# EAGLE schematic HackerboatControlBoard (EAGLE 6.6.0)

## Sheet 1 of 9
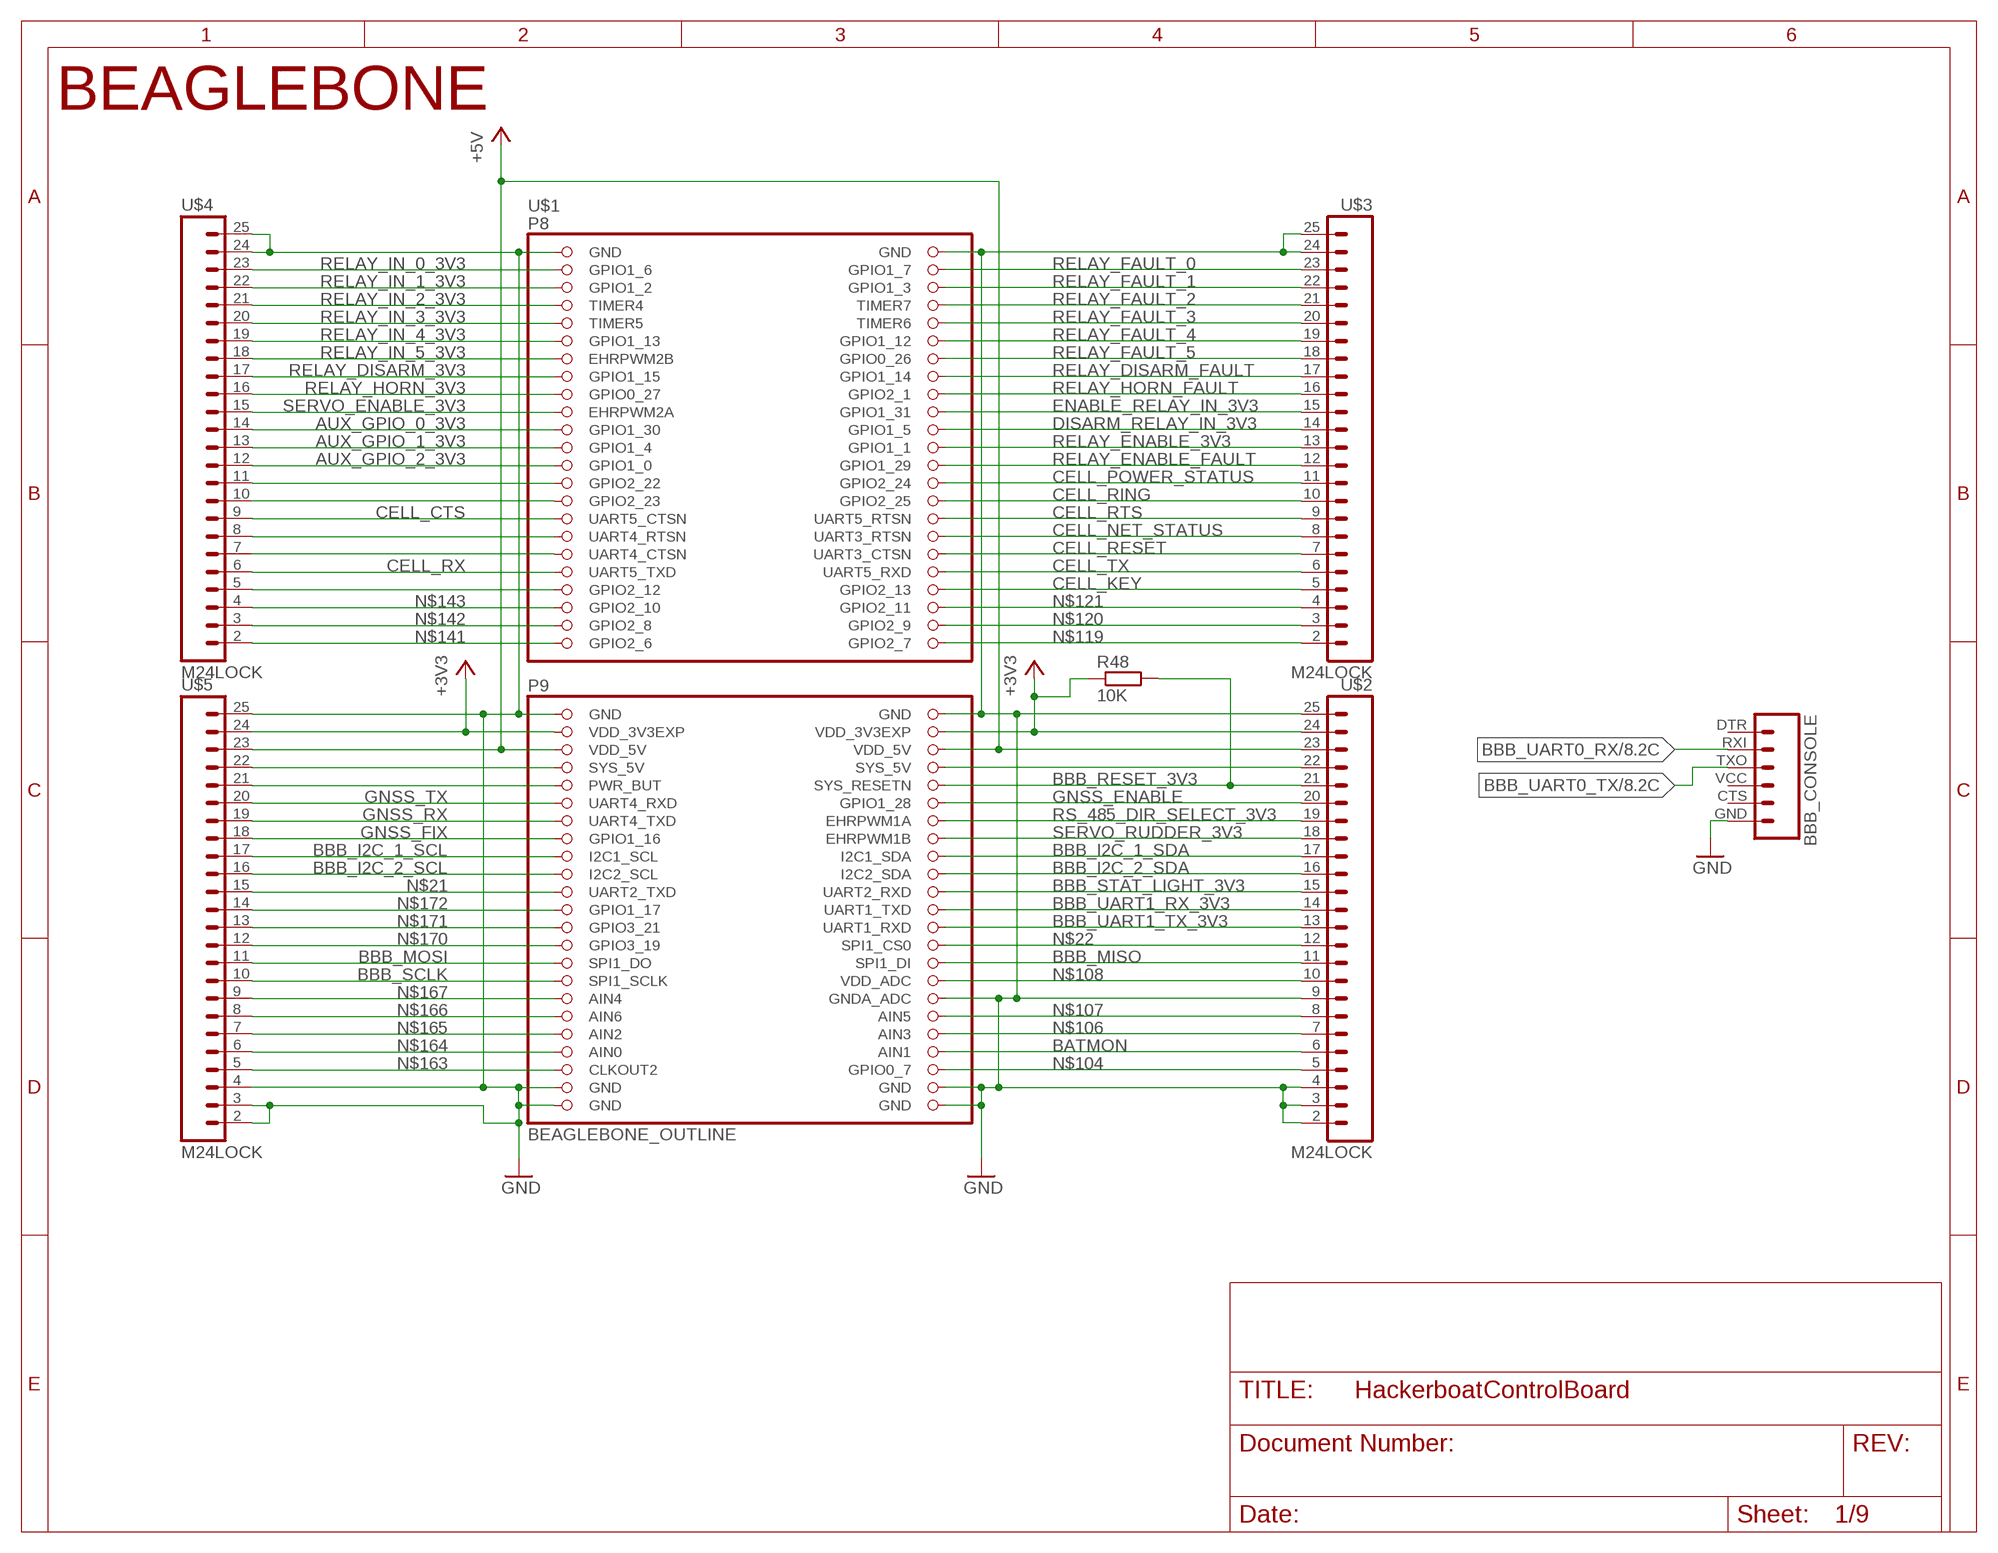
[diagram p0: schematic, sheet 1]

### Parts
BBB_CONSOLE  FTDI_BASICPTH  [FTDI_BASIC]
R48  10K  R-EU_R0603  [R0603]
U$1  BEAGLEBONE_OUTLINE  [BEAGLEBONE_SHIELD]
U$2  M24LOCK  [1X24_LOCK]
U$3  M24LOCK  [1X24_LOCK]
U$4  M24LOCK  [1X24_LOCK]
U$5  M24LOCK  [1X24_LOCK]

### Nets
+3V3: R48.1 U$1.49(VDD_3V3EXP) U$1.50(VDD_3V3EXP) U$2.24 U$5.24 ; also sheet 3,4,5,6,7,8,9
+5V: U$1.51(VDD_5V) U$1.52(VDD_5V) U$2.23 U$5.23 ; also sheet 2,3,4,5,6,7,8,9
AUX_GPIO_0_3V3: U$1.21(GPIO1_30) U$4.14 ; also sheet 7
AUX_GPIO_1_3V3: U$1.23(GPIO1_4) U$4.13 ; also sheet 7
AUX_GPIO_2_3V3: U$1.25(GPIO1_0) U$4.12 ; also sheet 7
BATMON: U$1.86(AIN1) U$2.6 ; also sheet 2
BBB_I2C_1_SCL: U$1.63(I2C1_SCL) U$5.17 ; also sheet 9
BBB_I2C_1_SDA: U$1.64(I2C1_SDA) U$2.17 ; also sheet 9
BBB_I2C_2_SCL: U$1.65(I2C2_SCL) U$5.16 ; also sheet 4
BBB_I2C_2_SDA: U$1.66(I2C2_SDA) U$2.16 ; also sheet 4
BBB_MISO: U$1.76(SPI1_DI) U$2.11 ; also sheet 7
BBB_MOSI: U$1.75(SPI1_DO) U$5.11 ; also sheet 7
BBB_RESET_3V3: R48.2 U$1.56(SYS_RESETN) U$2.21 ; also sheet 7
BBB_SCLK: U$1.77(SPI1_SCLK) U$5.10 ; also sheet 7
BBB_STAT_LIGHT_3V3: U$1.68(UART2_RXD) U$2.15
BBB_UART0_RX: BBB_CONSOLE.RXI ; also sheet 8
BBB_UART0_TX: BBB_CONSOLE.TXO ; also sheet 8
BBB_UART1_RX_3V3: U$1.70(UART1_TXD) U$2.14 ; also sheet 7
BBB_UART1_TX_3V3: U$1.72(UART1_RXD) U$2.13 ; also sheet 7
CELL_CTS: U$1.31(UART5_CTSN) U$4.9 ; also sheet 9
CELL_KEY: U$1.40(GPIO2_13) U$3.5 ; also sheet 9
CELL_NET_STATUS: U$1.34(UART3_RTSN) U$3.8 ; also sheet 9
CELL_POWER_STATUS: U$1.28(GPIO2_24) U$3.11 ; also sheet 9
CELL_RESET: U$1.36(UART3_CTSN) U$3.7 ; also sheet 9
CELL_RING: U$1.30(GPIO2_25) U$3.10 ; also sheet 9
CELL_RTS: U$1.32(UART5_RTSN) U$3.9 ; also sheet 9
CELL_RX: U$1.37(UART5_TXD) U$4.6 ; also sheet 9
CELL_TX: U$1.38(UART5_RXD) U$3.6 ; also sheet 3,9
DISARM_RELAY_IN_3V3: U$1.22(GPIO1_5) U$3.14 ; also sheet 7
ENABLE_RELAY_IN_3V3: U$1.20(GPIO1_31) U$3.15 ; also sheet 7
GND: BBB_CONSOLE.GND U$1.1(GND) U$1.2(GND) U$1.47(GND) U$1.48(GND) U$1.80(GNDA_ADC) U$1.89(GND) U$1.90(GND) U$1.91(GND) U$1.92(GND) U$2.2 U$2.3 U$2.4 U$2.9 U$2.25 U$3.24 U$3.25 U$4.24 U$4.25 U$5.2 U$5.3 U$5.4 U$5.25 ; also sheet 2,3,4,5,6,7,8,9
GNSS_ENABLE: U$1.58(GPIO1_28) U$2.20 ; also sheet 9
GNSS_FIX: U$1.61(GPIO1_16) U$5.18 ; also sheet 9
GNSS_RX: U$1.59(UART4_TXD) U$5.19 ; also sheet 9
GNSS_TX: U$1.57(UART4_RXD) U$5.20 ; also sheet 3,9
N$21: U$1.67(UART2_TXD) U$5.15
N$22: U$1.74(SPI1_CS0) U$2.12
N$46: U$1.27(GPIO2_22) U$4.11
N$47: U$1.29(GPIO2_23) U$4.10
N$56: U$1.33(UART4_RTSN) U$4.8
N$57: U$1.35(UART4_CTSN) U$4.7
N$58: U$1.39(GPIO2_12) U$4.5
N$104: U$1.88(GPIO0_7) U$2.5
N$106: U$1.84(AIN3) U$2.7
N$107: U$1.82(AIN5) U$2.8
N$108: U$1.78(VDD_ADC) U$2.10
N$117: U$1.54(SYS_5V) U$2.22
N$119: U$1.46(GPIO2_7) U$3.2
N$120: U$1.44(GPIO2_9) U$3.3
N$121: U$1.42(GPIO2_11) U$3.4
N$141: U$1.45(GPIO2_6) U$4.2
N$142: U$1.43(GPIO2_8) U$4.3
N$143: U$1.41(GPIO2_10) U$4.4
N$163: U$1.87(CLKOUT2) U$5.5
N$164: U$1.85(AIN0) U$5.6
N$165: U$1.83(AIN2) U$5.7
N$166: U$1.81(AIN6) U$5.8
N$167: U$1.79(AIN4) U$5.9
N$170: U$1.73(GPIO3_19) U$5.12
N$171: U$1.71(GPIO3_21) U$5.13
N$172: U$1.69(GPIO1_17) U$5.14
N$176: U$1.55(PWR_BUT) U$5.21
RELAY_DISARM_3V3: U$1.15(GPIO1_15) U$4.17 ; also sheet 7
RELAY_DISARM_FAULT: U$1.16(GPIO1_14) U$3.17 ; also sheet 6,8
RELAY_ENABLE_3V3: U$1.24(GPIO1_1) U$3.13 ; also sheet 7
RELAY_ENABLE_FAULT: U$1.26(GPIO1_29) U$3.12 ; also sheet 6,8
RELAY_FAULT_0: U$1.4(GPIO1_7) U$3.23 ; also sheet 5,8
RELAY_FAULT_1: U$1.6(GPIO1_3) U$3.22 ; also sheet 5,8
RELAY_FAULT_2: U$1.8(TIMER7) U$3.21 ; also sheet 5,8
RELAY_FAULT_3: U$1.10(TIMER6) U$3.20 ; also sheet 5,8
RELAY_FAULT_4: U$1.12(GPIO1_12) U$3.19 ; also sheet 5,8
RELAY_FAULT_5: U$1.14(GPIO0_26) U$3.18 ; also sheet 5,8
RELAY_HORN_3V3: U$1.17(GPIO0_27) U$4.16 ; also sheet 7
RELAY_HORN_FAULT: U$1.18(GPIO2_1) U$3.16 ; also sheet 6,8
RELAY_IN_0_3V3: U$1.3(GPIO1_6) U$4.23 ; also sheet 7
RELAY_IN_1_3V3: U$1.5(GPIO1_2) U$4.22 ; also sheet 7
RELAY_IN_2_3V3: U$1.7(TIMER4) U$4.21 ; also sheet 7
RELAY_IN_3_3V3: U$1.9(TIMER5) U$4.20 ; also sheet 7
RELAY_IN_4_3V3: U$1.11(GPIO1_13) U$4.19 ; also sheet 7
RELAY_IN_5_3V3: U$1.13(EHRPWM2B) U$4.18 ; also sheet 7
RS_485_DIR_SELECT_3V3: U$1.60(EHRPWM1A) U$2.19 ; also sheet 7
SERVO_ENABLE_3V3: U$1.19(EHRPWM2A) U$4.15 ; also sheet 7
SERVO_RUDDER_3V3: U$1.62(EHRPWM1B) U$2.18 ; also sheet 7
SYS_5V: U$1.53(SYS_5V) U$5.22
Unconnected: BBB_CONSOLE.CTS BBB_CONSOLE.DTR BBB_CONSOLE.VCC

### Notes on the sheet
- BEAGLEBONE

## Sheet 2 of 9
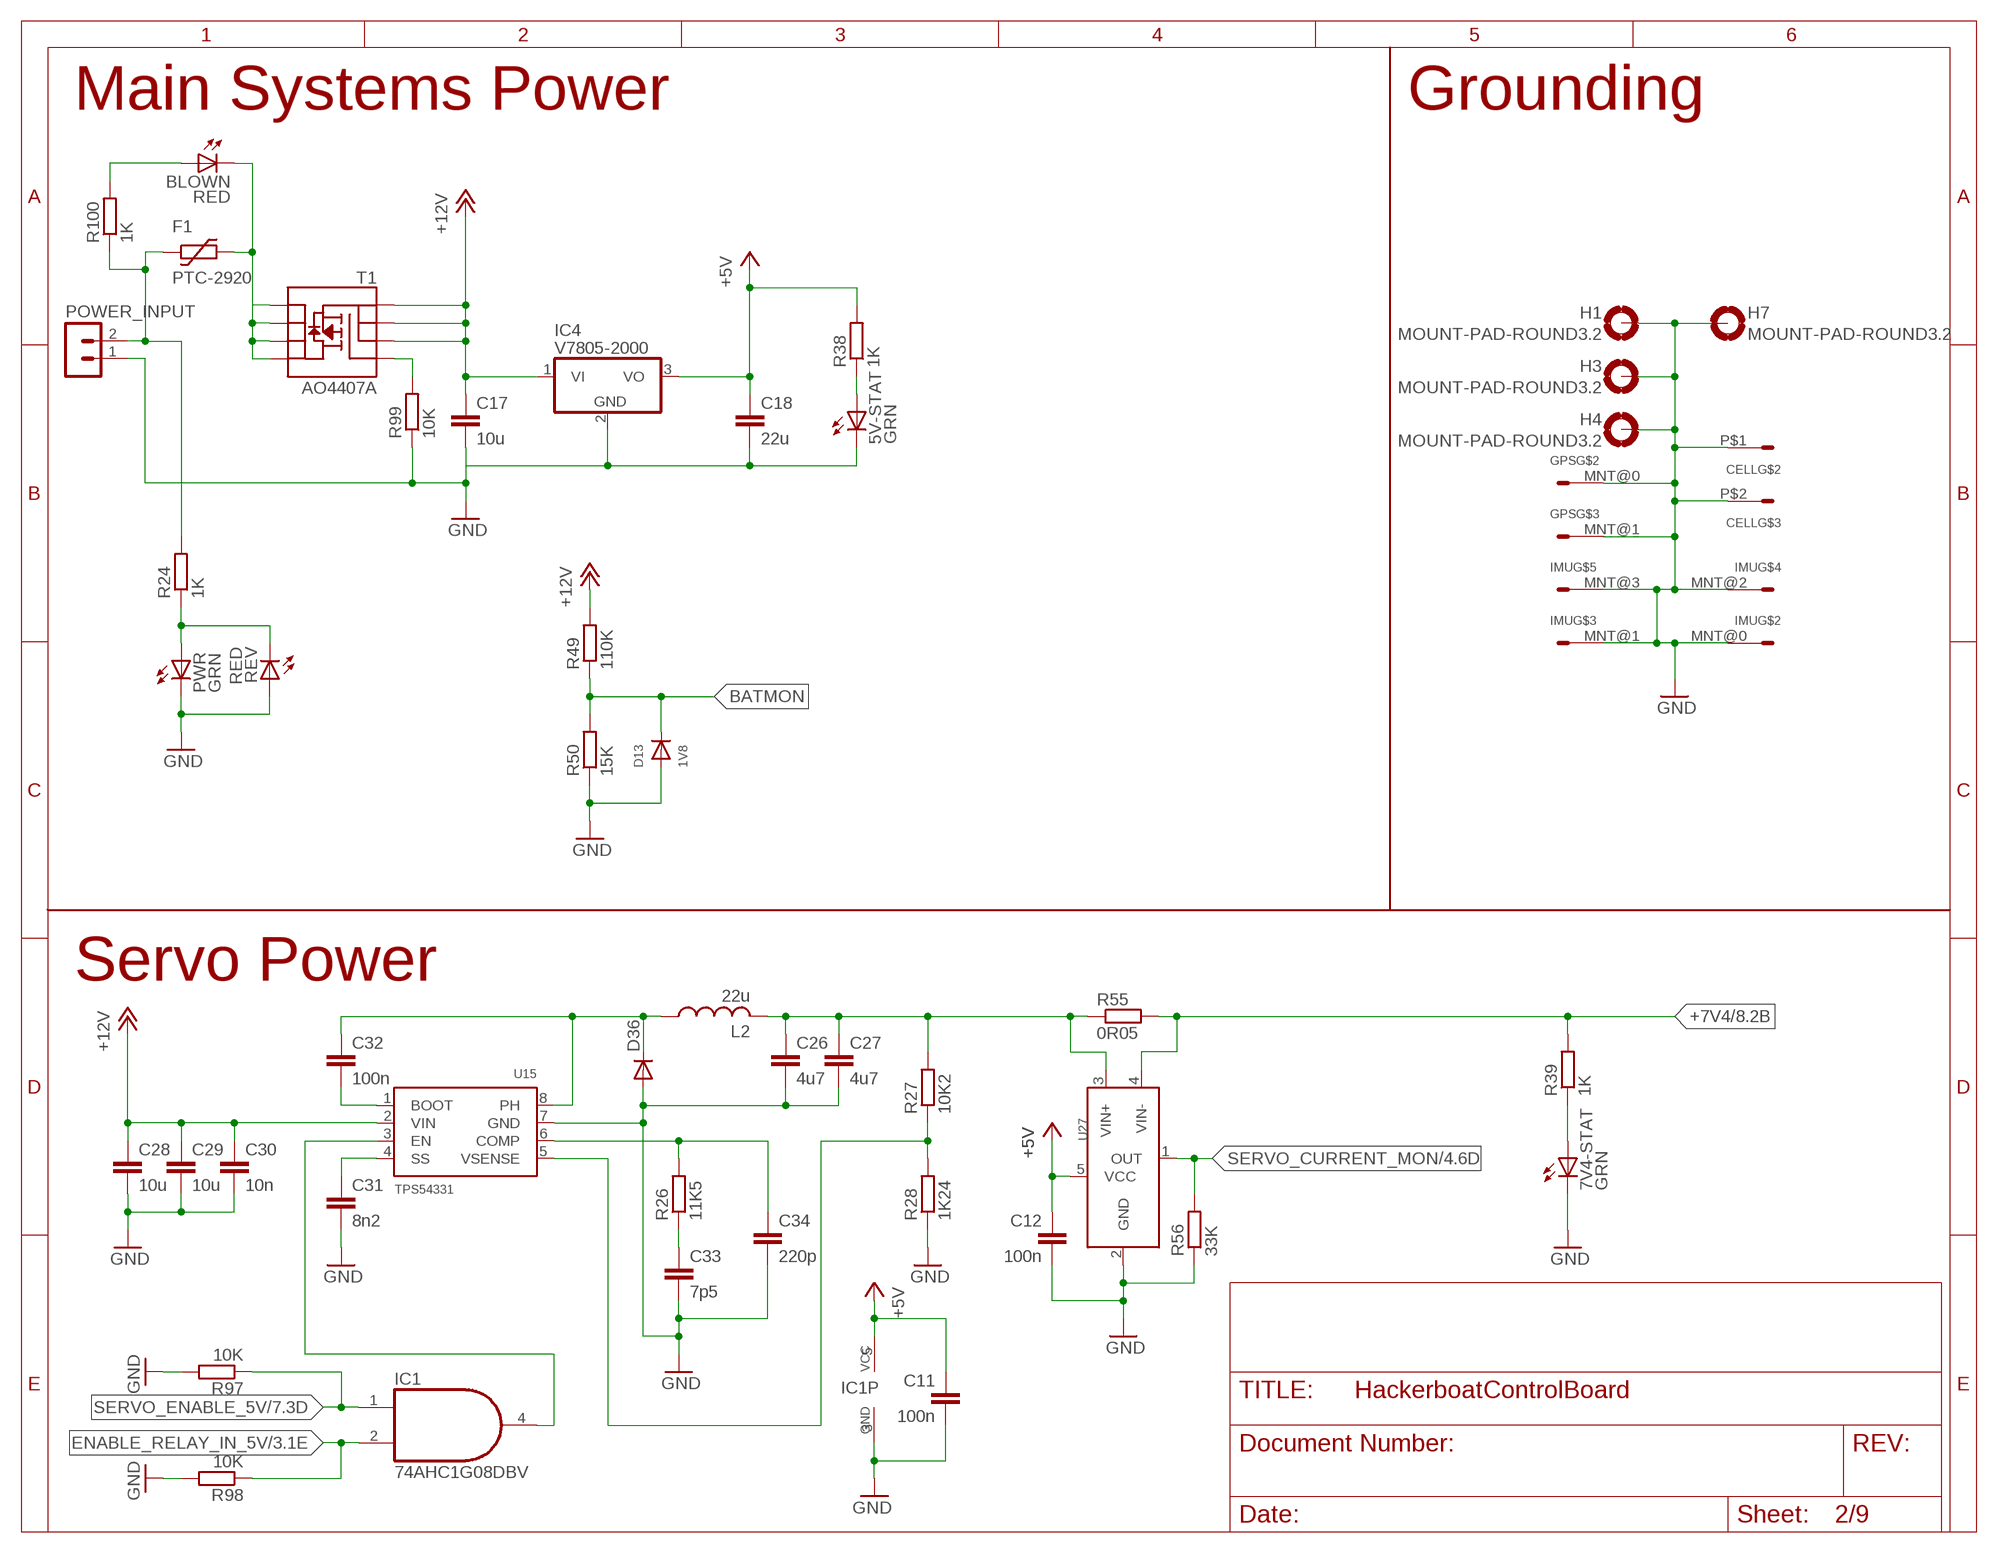
[diagram p1: schematic, sheet 2]

### Parts
5V-STAT  GRN  LEDCHIPLED_0805  [CHIPLED_0805]
7V4-STAT  GRN  LEDCHIPLED_0805  [CHIPLED_0805]
BLOWN  RED  LEDCHIPLED_0805  [CHIPLED_0805]
C11  100n  C-EUC0603  [C0603]
C12  100n  C-EUC0603  [C0603]
C17  10u  C-EUC1210  [C1210]
C18  22u  C-EUC1210  [C1210]
C26  4u7  C-EUC1210  [C1210]
C27  4u7  C-EUC1210  [C1210]
C28  10u  C-EUC1210  [C1210]
C29  10u  C-EUC1210  [C1210]
C30  10n  C-EUC0603  [C0603]
C31  8n2  C-EUC0603  [C0603]
C32  100n  C-EUC0603  [C0603]
C33  7p5  C-EUC0603  [C0603]
C34  220p  C-EUC0603  [C0603]
CELL  FONA  [FONA-3G]
D13  1V8  DIODESOD-123  [SOD-123]
D36  SPARKFUN_DIODESMA  [SPARKFUN_SMA-DIODE]
F1  PTC-2920  [2920L]
GPS  ULTIMATE-GPS  [ULTIMATE-GPS]
H1  MOUNT-PAD-ROUND3.2  [3,2-PAD]
H3  MOUNT-PAD-ROUND3.2  [3,2-PAD]
H4  MOUNT-PAD-ROUND3.2  [3,2-PAD]
H7  MOUNT-PAD-ROUND3.2  [3,2-PAD]
IC1  74AHC1G08DBV  [SOT23-5]
IC4  V7805-2000  7805TV  [TO220V]
IMU  9-DOF-BREAKOUT  [9-DOF-BREAKOUT]
L2  22u  NR6045  [NR60XX]
POWER_INPUT  3-1437664-0  [CONN-2]
PWR  GRN  LEDCHIPLED_0805  [CHIPLED_0805]
R24  1K  R-EU_R0603  [R0603]
R26  11K5  R-EU_R0603  [R0603]
R27  10K2  R-EU_R0603  [R0603]
R28  1K24  R-EU_R0603  [R0603]
R38  1K  R-EU_R0603  [R0603]
R39  1K  R-EU_R0603  [R0603]
R49  110K  R-EU_R0603  [R0603]
R50  15K  R-EU_R0603  [R0603]
R55  0R05  R-EU_R2512  [R2512]
R56  33K  R-EU_R0603  [R0603]
R97  10K  R-EU_R0603  [R0603]
R98  10K  R-EU_R0603  [R0603]
R99  10K  R-EU_R0603  [R0603]
R100  1K  R-EU_R0603  [R0603]
REV  RED  LEDCHIPLED_0805  [CHIPLED_0805]
T1  AO4407A  MOSFET-PCHANNEL-SOIC8SOIC8  [SO08]
U15  TPS54331  [SO08]
U27  INA169  [SOT23-5L]

### Nets
+5V: C11.1 C12.1 C18.1 IC1.5(VCC) IC4.3(VO) R38.2 U27.5(VCC) ; also sheet 1,3,4,5,6,7,8,9
+7V4: R39.2 R55.2 U27.4(VIN-) ; also sheet 8
+7V4_OUT: C26.1 C27.1 L2.2 R27.2 R55.1 U27.3(VIN+)
+12V: C17.1 C28.1 C29.1 C30.1 IC4.1(VI) R49.2 T1.1(S) T1.2(S) T1.3(S) U15.2(VIN) ; also sheet 3,5,6,9
BATMON: D13.C R49.1 R50.2 ; also sheet 1
ENABLE_RELAY_IN_5V: IC1.2(I1) R98.1 ; also sheet 3,7
GND: 5V-STAT.C 7V4-STAT.C C11.2 C12.2 C17.2 C18.2 C26.2 C27.2 C28.2 C29.2 C30.2 C31.2 C33.2 C34.2 CELL.P$1 CELL.P$2 D13.A D36.A GPS.MNT@0 GPS.MNT@1 H1.B3,2(MOUNT) H3.B3,2(MOUNT) H4.B3,2(MOUNT) H7.B3,2(MOUNT) IC1.3(GND) IC4.2(GND) IMU.MNT@0 IMU.MNT@1 IMU.MNT@2 IMU.MNT@3 POWER_INPUT.1 PWR.C R28.1 R50.1 R56.1 R97.2 R98.2 R99.1 REV.A U15.7(GND) U27.2(GND) ; also sheet 1,3,4,5,6,7,8,9
N$36: IC1.4(O) U15.3(EN)
N$72: C31.1 U15.4(SS)
N$78: C32.2 U15.1(BOOT)
N$79: C32.1 D36.C L2.1 U15.8(PH)
N$80: C33.1 R26.1
N$81: C34.1 R26.2 U15.6(COMP)
N$82: R27.1 R28.2 U15.5(VSENSE)
N$96: BLOWN.C F1.P$2 T1.5(D) T1.6(D) T1.7(D) T1.8(D)
N$97: R99.2 T1.4(G)
N$98: F1.P$1 POWER_INPUT.2 R24.2 R100.1
N$99: BLOWN.A R100.2
N$177: PWR.A R24.1 REV.C
N$182: 5V-STAT.A R38.1
N$183: 7V4-STAT.A R39.1
SERVO_CURRENT_MON: R56.2 U27.1(OUT) ; also sheet 4
SERVO_ENABLE_5V: IC1.1(I0) R97.1 ; also sheet 7

### Notes on the sheet
- Main Systems Power | Grounding
- Servo Power

## Sheet 3 of 9
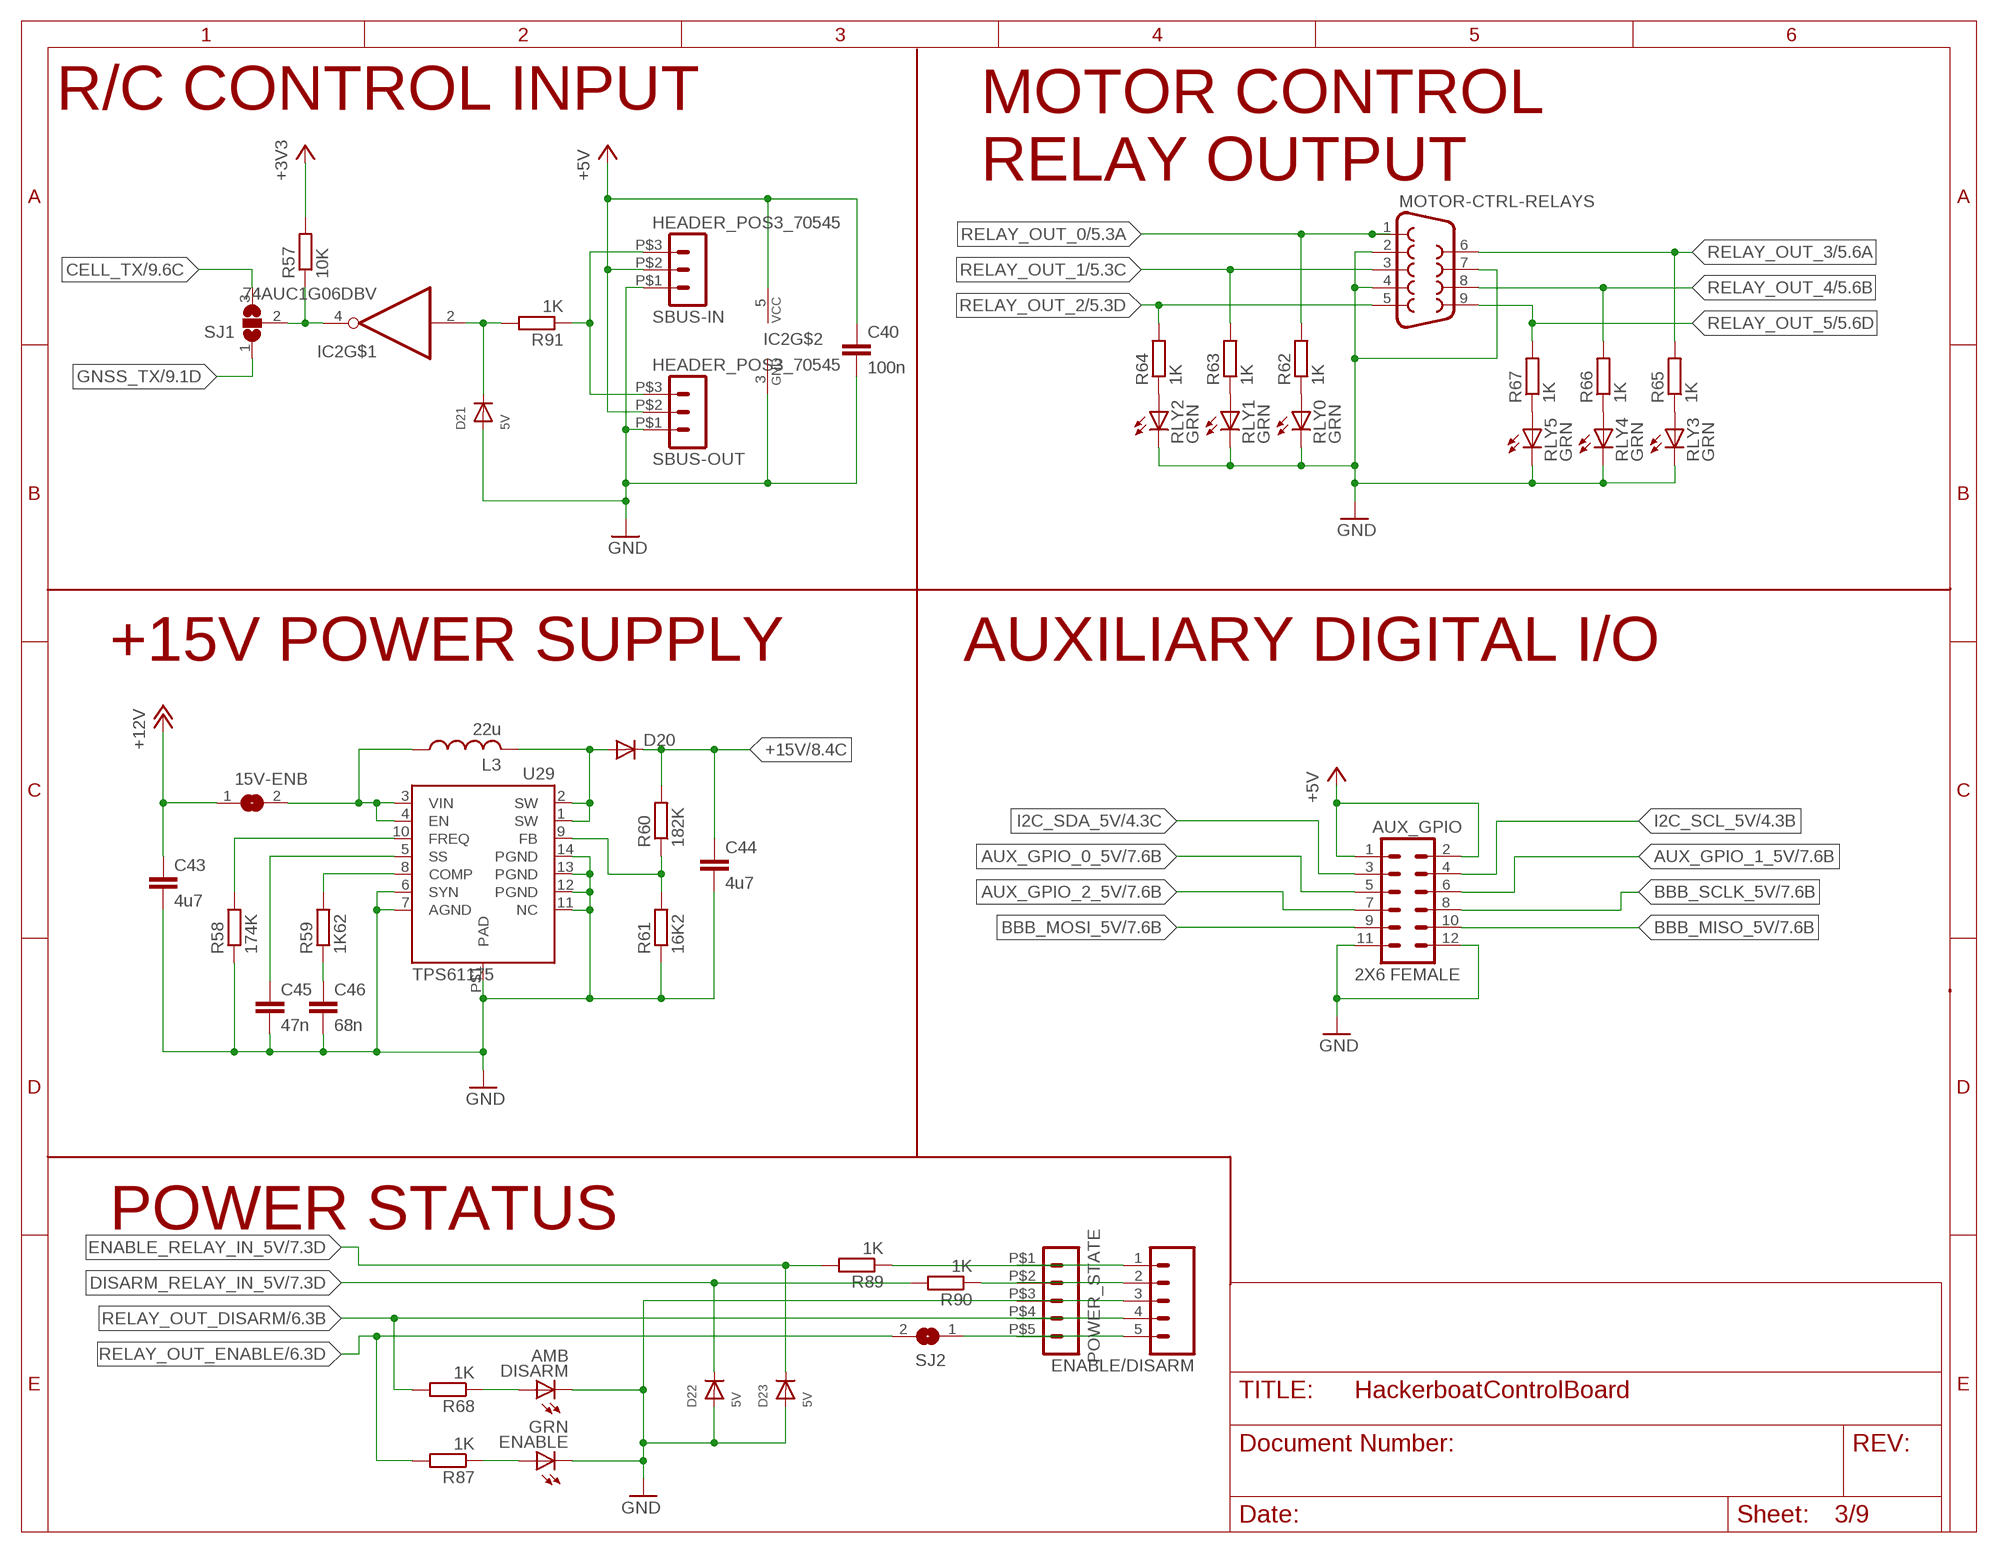
[diagram p2: schematic, sheet 3]

### Parts
15V-ENB  SJ  [SJ]
AUX_GPIO  2X6 FEMALE  M06X2PTH_FEMALE  [2X6]
C40  100n  C-EUC0603  [C0603]
C43  4u7  C-EUC1210  [C1210]
C44  4u7  C-EUC1210  [C1210]
C45  47n  C-EUC0603  [C0603]
C46  68n  C-EUC0603  [C0603]
D20  SPARKFUN_DIODESMA  [SPARKFUN_SMA-DIODE]
D21  5V  DIODESOD-123  [SOD-123]
D22  5V  DIODESOD-123  [SOD-123]
D23  5V  DIODESOD-123  [SOD-123]
DISARM  AMB  LEDCHIPLED_0805  [CHIPLED_0805]
ENABLE  GRN  LEDCHIPLED_0805  [CHIPLED_0805]
ENABLE/DISARM  M05LOCK  [1X05_LOCK]
IC2  74AUC1G06DBV  [SOT23-5]
L3  22u  SRN8040  [SRN8040]
MOTOR-CTRL-RELAYS  DB9FEMALE  [DB9]
POWER_STATE  HEADER_POS5_70555  [70555-POS5]
R57  10K  R-EU_R0603  [R0603]
R58  174K  R-EU_R0603  [R0603]
R59  1K62  R-EU_R0603  [R0603]
R60  182K  R-EU_R0603  [R0603]
R61  16K2  R-EU_R0603  [R0603]
R62  1K  R-EU_R0603  [R0603]
R63  1K  R-EU_R0603  [R0603]
R64  1K  R-EU_R0603  [R0603]
R65  1K  R-EU_R0603  [R0603]
R66  1K  R-EU_R0603  [R0603]
R67  1K  R-EU_R0603  [R0603]
R68  1K  R-EU_R0603  [R0603]
R87  1K  R-EU_R0603  [R0603]
R89  1K  R-EU_R0603  [R0603]
R90  1K  R-EU_R0603  [R0603]
R91  1K  R-EU_R0603  [R0603]
RLY0  GRN  LEDCHIPLED_0805  [CHIPLED_0805]
RLY1  GRN  LEDCHIPLED_0805  [CHIPLED_0805]
RLY2  GRN  LEDCHIPLED_0805  [CHIPLED_0805]
RLY3  GRN  LEDCHIPLED_0805  [CHIPLED_0805]
RLY4  GRN  LEDCHIPLED_0805  [CHIPLED_0805]
RLY5  GRN  LEDCHIPLED_0805  [CHIPLED_0805]
SBUS-IN  HEADER_POS3_70545  [70545-POS3]
SBUS-OUT  HEADER_POS3_70545  [70545-POS3]
SJ1  SJ2W  [SJ_2]
SJ2  SJ  [SJ]
U29  TPS61175  [HTSSOP14]

### Nets
+3V3: R57.2 ; also sheet 1,4,5,6,7,8,9
+5V: AUX_GPIO.1 AUX_GPIO.2 C40.1 IC2.5(VCC) SBUS-IN.P$2 SBUS-OUT.P$2 ; also sheet 1,2,4,5,6,7,8,9
+12V: 15V-ENB.1 C43.1 ; also sheet 2,5,6,9
+15V: C44.1 D20.C R60.2 ; also sheet 8
AUX_GPIO_0_5V: AUX_GPIO.5 ; also sheet 7
AUX_GPIO_1_5V: AUX_GPIO.6 ; also sheet 7
AUX_GPIO_2_5V: AUX_GPIO.7 ; also sheet 7
BBB_MISO_5V: AUX_GPIO.10 ; also sheet 7
BBB_MOSI_5V: AUX_GPIO.9 ; also sheet 7
BBB_SCLK_5V: AUX_GPIO.8 ; also sheet 7
CELL_TX: SJ1.3 ; also sheet 1,9
DISARM_RELAY_IN_5V: D22.C R90.2 ; also sheet 7
ENABLE_RELAY_IN_5V: D23.C R89.2 ; also sheet 2,7
GND: AUX_GPIO.11 AUX_GPIO.12 C40.2 C43.2 C44.2 C45.2 C46.2 D21.A D22.A D23.A DISARM.C ENABLE.C ENABLE/DISARM.3 IC2.3(GND) MOTOR-CTRL-RELAYS.2 MOTOR-CTRL-RELAYS.4 MOTOR-CTRL-RELAYS.7 POWER_STATE.P$3 R58.1 R61.1 RLY0.C RLY1.C RLY2.C RLY3.C RLY4.C RLY5.C SBUS-IN.P$1 SBUS-OUT.P$1 U29.6(SYN) U29.7(AGND) U29.11(NC) U29.12(PGND) U29.13(PGND) U29.14(PGND) U29.P$1(PAD) ; also sheet 1,2,4,5,6,7,8,9
GNSS_TX: SJ1.1 ; also sheet 1,9
I2C_SCL_5V: AUX_GPIO.4 ; also sheet 4
I2C_SDA_5V: AUX_GPIO.3 ; also sheet 4
N$53: D21.C IC2.2(I) R91.2
N$55: IC2.4(O) R57.1 SJ1.2
N$59: R62.1 RLY0.A
N$60: R63.1 RLY1.A
N$61: R64.1 RLY2.A
N$64: DISARM.A R68.1
N$65: R65.1 RLY3.A
N$66: R66.1 RLY4.A
N$67: R67.1 RLY5.A
N$71: ENABLE.A R87.1
N$75: C46.1 R59.1
N$76: R59.2 U29.8(COMP)
N$77: C45.1 U29.5(SS)
N$83: R58.2 U29.10(FREQ)
N$84: D20.A L3.2 U29.1(SW) U29.2(SW)
N$85: R60.1 R61.2 U29.9(FB)
N$87: ENABLE/DISARM.1 POWER_STATE.P$1 R89.1
N$88: ENABLE/DISARM.2 POWER_STATE.P$2 R90.1
N$94: 15V-ENB.2 L3.1 U29.3(VIN) U29.4(EN)
N$95: ENABLE/DISARM.5 POWER_STATE.P$5 SJ2.1
RELAY_OUT_0: MOTOR-CTRL-RELAYS.1 R62.2 ; also sheet 5
RELAY_OUT_1: MOTOR-CTRL-RELAYS.3 R63.2 ; also sheet 5
RELAY_OUT_2: MOTOR-CTRL-RELAYS.5 R64.2 ; also sheet 5
RELAY_OUT_3: MOTOR-CTRL-RELAYS.6 R65.2 ; also sheet 5
RELAY_OUT_4: MOTOR-CTRL-RELAYS.8 R66.2 ; also sheet 5
RELAY_OUT_5: MOTOR-CTRL-RELAYS.9 R67.2 ; also sheet 5
RELAY_OUT_DISARM: ENABLE/DISARM.4 POWER_STATE.P$4 R68.2 ; also sheet 6
RELAY_OUT_ENABLE: R87.2 SJ2.2 ; also sheet 6
SBUS_IN_5V: R91.1 SBUS-IN.P$3 SBUS-OUT.P$3

### Notes on the sheet
- R/C CONTROL INPUT
- MOTOR CONTROL 
  RELAY OUTPUT
- +15V POWER SUPPLY | AUXILIARY DIGITAL I/O
- POWER STATUS

## Sheet 4 of 9
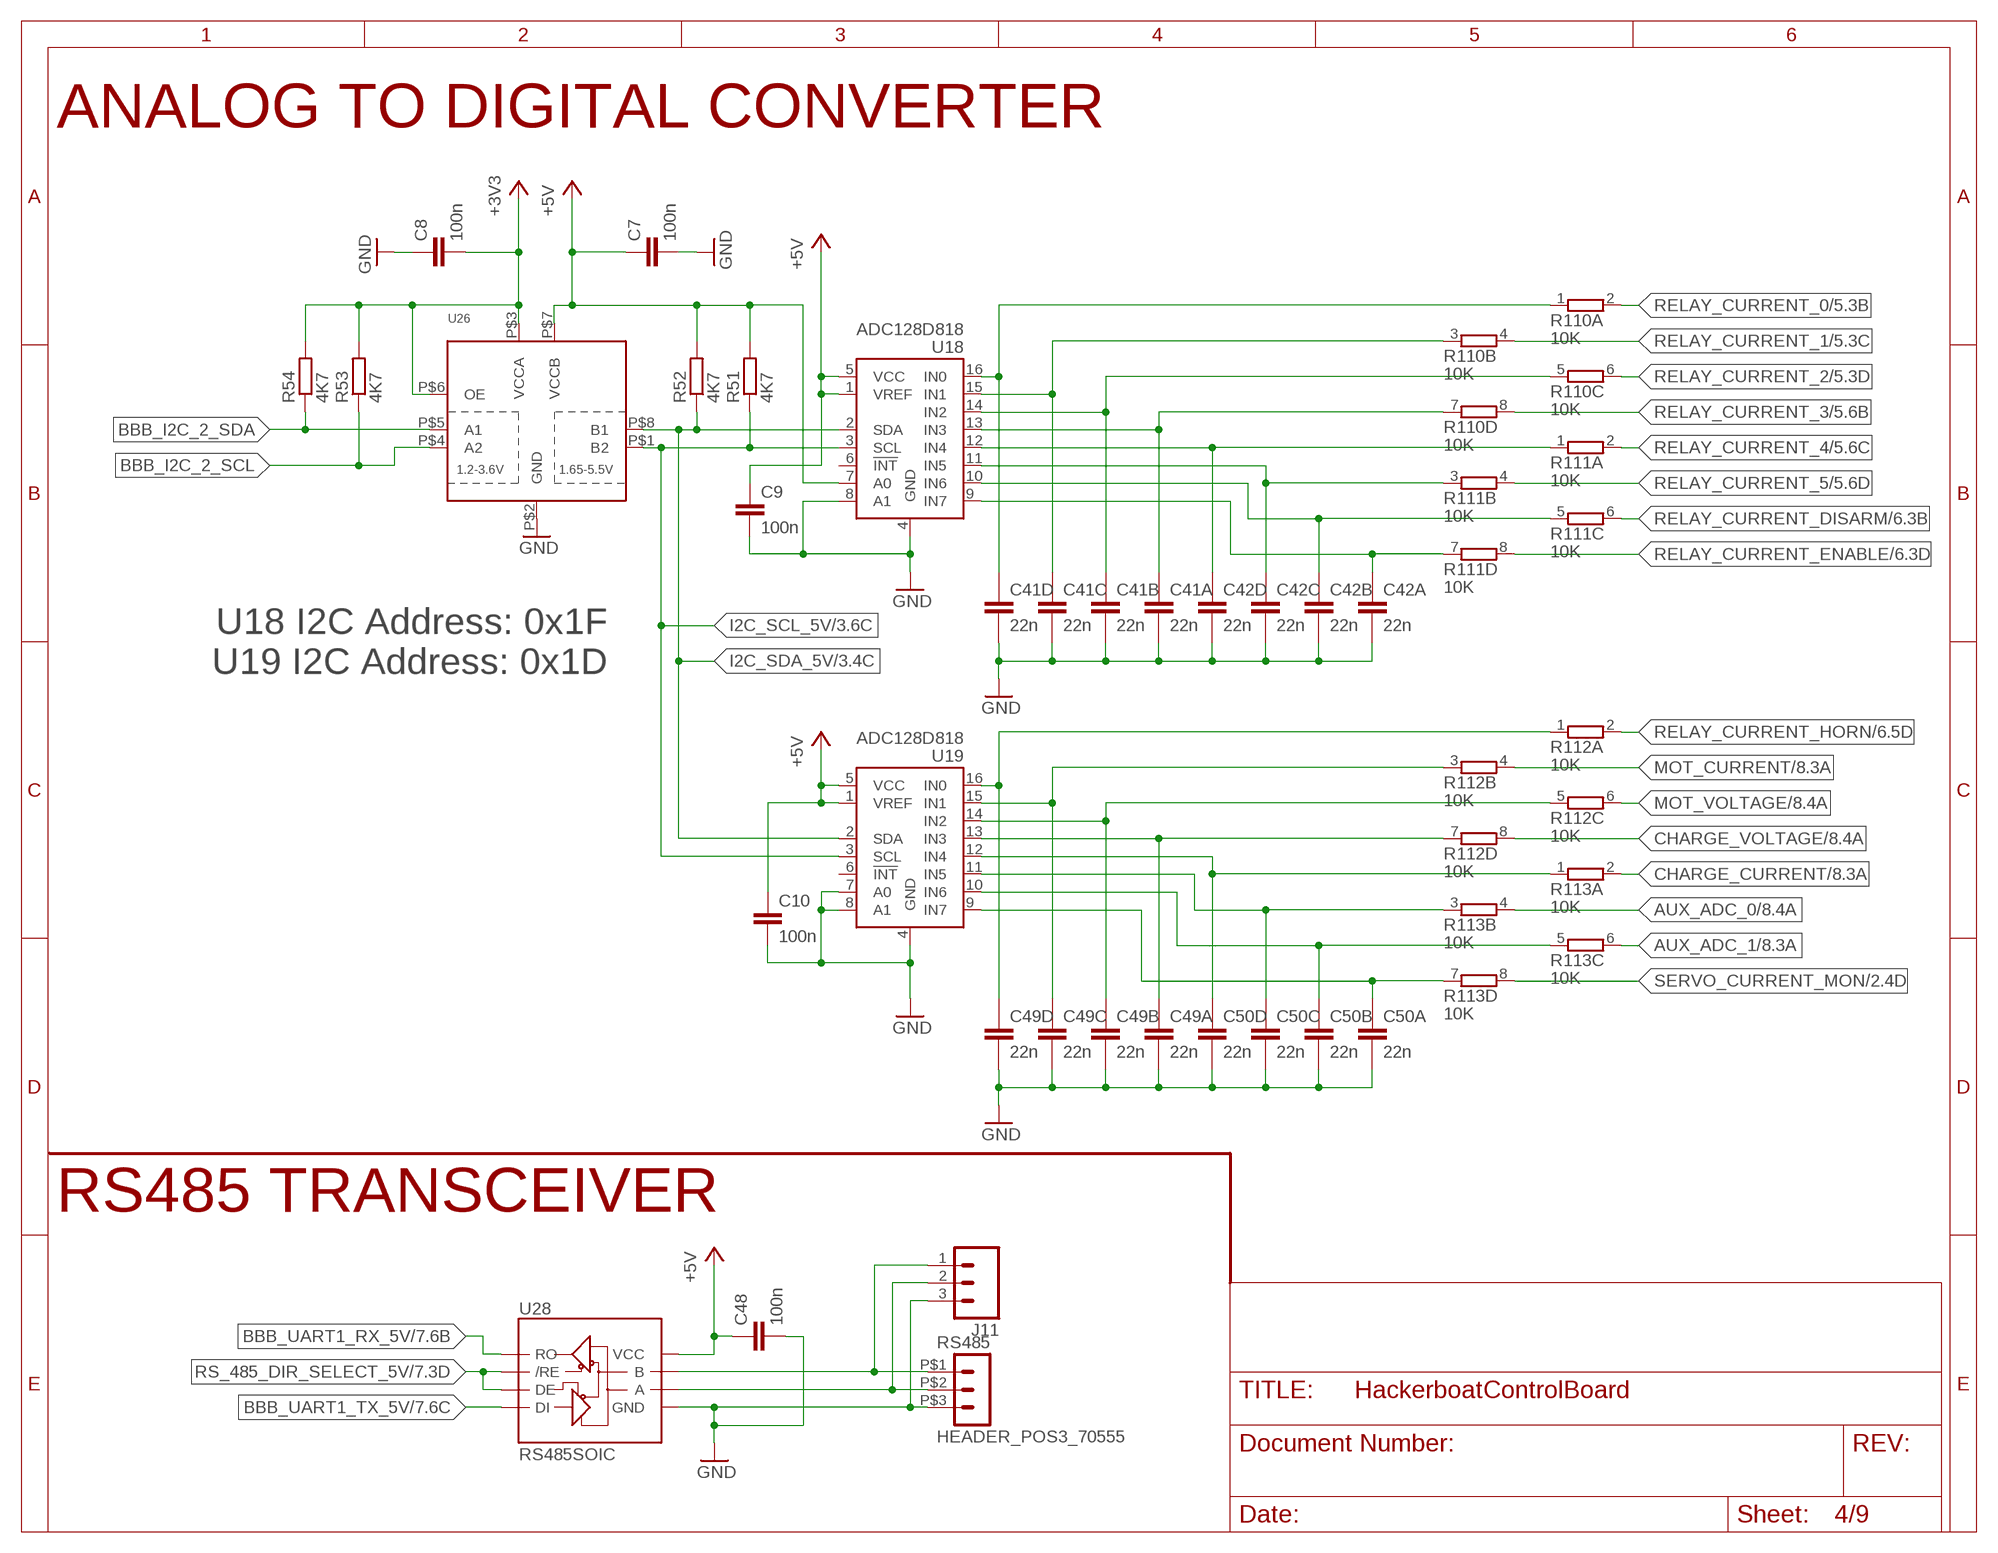
[diagram p3: schematic, sheet 4]

### Parts
C7  100n  C-EUC0603  [C0603]
C8  100n  C-EUC0603  [C0603]
C9  100n  C-EUC0603  [C0603]
C10  100n  C-EUC0603  [C0603]
C41  22n  4CAP0805  [0805X4-CAP]
C42  22n  4CAP0805  [0805X4-CAP]
C48  100n  C-EUC0603  [C0603]
C49  22n  4CAP0805  [0805X4-CAP]
C50  22n  4CAP0805  [0805X4-CAP]
J11  M03LOCK  [1X03_LOCK]
R51  4K7  R-EU_R0603  [R0603]
R52  4K7  R-EU_R0603  [R0603]
R53  4K7  R-EU_R0603  [R0603]
R54  4K7  R-EU_R0603  [R0603]
R110  10K  4R-NCTS742C083  [CTS742C083-RES]
R111  10K  4R-NCTS742C083  [CTS742C083-RES]
R112  10K  4R-NCTS742C083  [CTS742C083-RES]
R113  10K  4R-NCTS742C083  [CTS742C083-RES]
RS485  HEADER_POS3_70555  [70555-POS3]
U18  ADC128D818  [TSSOP16]
U19  ADC128D818  [TSSOP16]
U26  TXS0102  [VFSOP-8]
U28  RS485SOIC  [SO08]

### Nets
+3V3: C8.2 R53.2 R54.2 U26.P$3(VCCA) U26.P$6(OE) ; also sheet 1,3,5,6,7,8,9
+5V: C7.1 C9.1 C10.1 C48.1 R51.2 R52.2 U18.1(VREF) U18.5(VCC) U18.7(A0) U19.1(VREF) U19.5(VCC) U26.P$7(VCCB) U28.8(VCC) ; also sheet 1,2,3,5,6,7,8,9
AUX_ADC_0: R113.4 ; also sheet 8
AUX_ADC_1: R113.6 ; also sheet 8
BBB_I2C_2_SCL: R53.1 U26.P$4(A2) ; also sheet 1
BBB_I2C_2_SDA: R54.1 U26.P$5(A1) ; also sheet 1
BBB_UART1_RX_5V: U28.1(RO) ; also sheet 7
BBB_UART1_TX_5V: U28.4(DI) ; also sheet 7
CHARGE_CURRENT: R113.2 ; also sheet 8
CHARGE_VOLTAGE: R112.8 ; also sheet 8
GND: C7.2 C8.1 C9.2 C10.2 C41.2 C41.4 C41.6 C41.8 C42.2 C42.4 C42.6 C42.8 C48.2 C49.2 C49.4 C49.6 C49.8 C50.2 C50.4 C50.6 C50.8 J11.3 RS485.P$3 U18.4(GND) U18.8(A1) U19.4(GND) U19.7(A0) U19.8(A1) U26.P$2(GND) U28.5(GND) ; also sheet 1,2,3,5,6,7,8,9
I2C_SCL_5V: R51.1 U18.3(SCL) U19.3(SCL) U26.P$1(B2) ; also sheet 3
I2C_SDA_5V: R52.1 U18.2(SDA) U19.2(SDA) U26.P$8(B1) ; also sheet 3
MOT_CURRENT: R112.4 ; also sheet 8
MOT_VOLTAGE: R112.6 ; also sheet 8
N$27: J11.1 RS485.P$1 U28.7(B)
N$86: J11.2 RS485.P$2 U28.6(A)
N$113: C41.7 R110.1 U18.16(IN0)
N$114: C41.5 R110.3 U18.15(IN1)
N$115: C49.7 R112.1 U19.16(IN0)
N$116: C41.3 R110.5 U18.14(IN2)
N$118: C41.1 R110.7 U18.13(IN3)
N$122: C42.7 R111.1 U18.12(IN4)
N$123: C42.5 R111.3 U18.11(IN5)
N$124: C42.3 R111.5 U18.10(IN6)
N$125: C42.1 R111.7 U18.9(IN7)
N$126: C49.5 R112.3 U19.15(IN1)
N$127: C49.3 R112.5 U19.14(IN2)
N$128: C49.1 R112.7 U19.13(IN3)
N$129: C50.7 R113.1 U19.12(IN4)
N$130: C50.5 R113.3 U19.11(IN5)
N$131: C50.3 R113.5 U19.10(IN6)
N$132: C50.1 R113.7 U19.9(IN7)
RELAY_CURRENT_0: R110.2 ; also sheet 5
RELAY_CURRENT_1: R110.4 ; also sheet 5
RELAY_CURRENT_2: R110.6 ; also sheet 5
RELAY_CURRENT_3: R110.8 ; also sheet 5
RELAY_CURRENT_4: R111.2 ; also sheet 5
RELAY_CURRENT_5: R111.4 ; also sheet 5
RELAY_CURRENT_DISARM: R111.6 ; also sheet 6
RELAY_CURRENT_ENABLE: R111.8 ; also sheet 6
RELAY_CURRENT_HORN: R112.2 ; also sheet 6
RS_485_DIR_SELECT_5V: U28.2(/RE) U28.3(DE) ; also sheet 7
SERVO_CURRENT_MON: R113.8 ; also sheet 2
Unconnected: U18.6(!INT!) U19.6(!INT!)

### Notes on the sheet
- ANALOG TO DIGITAL CONVERTER
- U18 I2C Address: 0x1F
  U19 I2C Address: 0x1D
- RS485 TRANSCEIVER

## Sheet 5 of 9
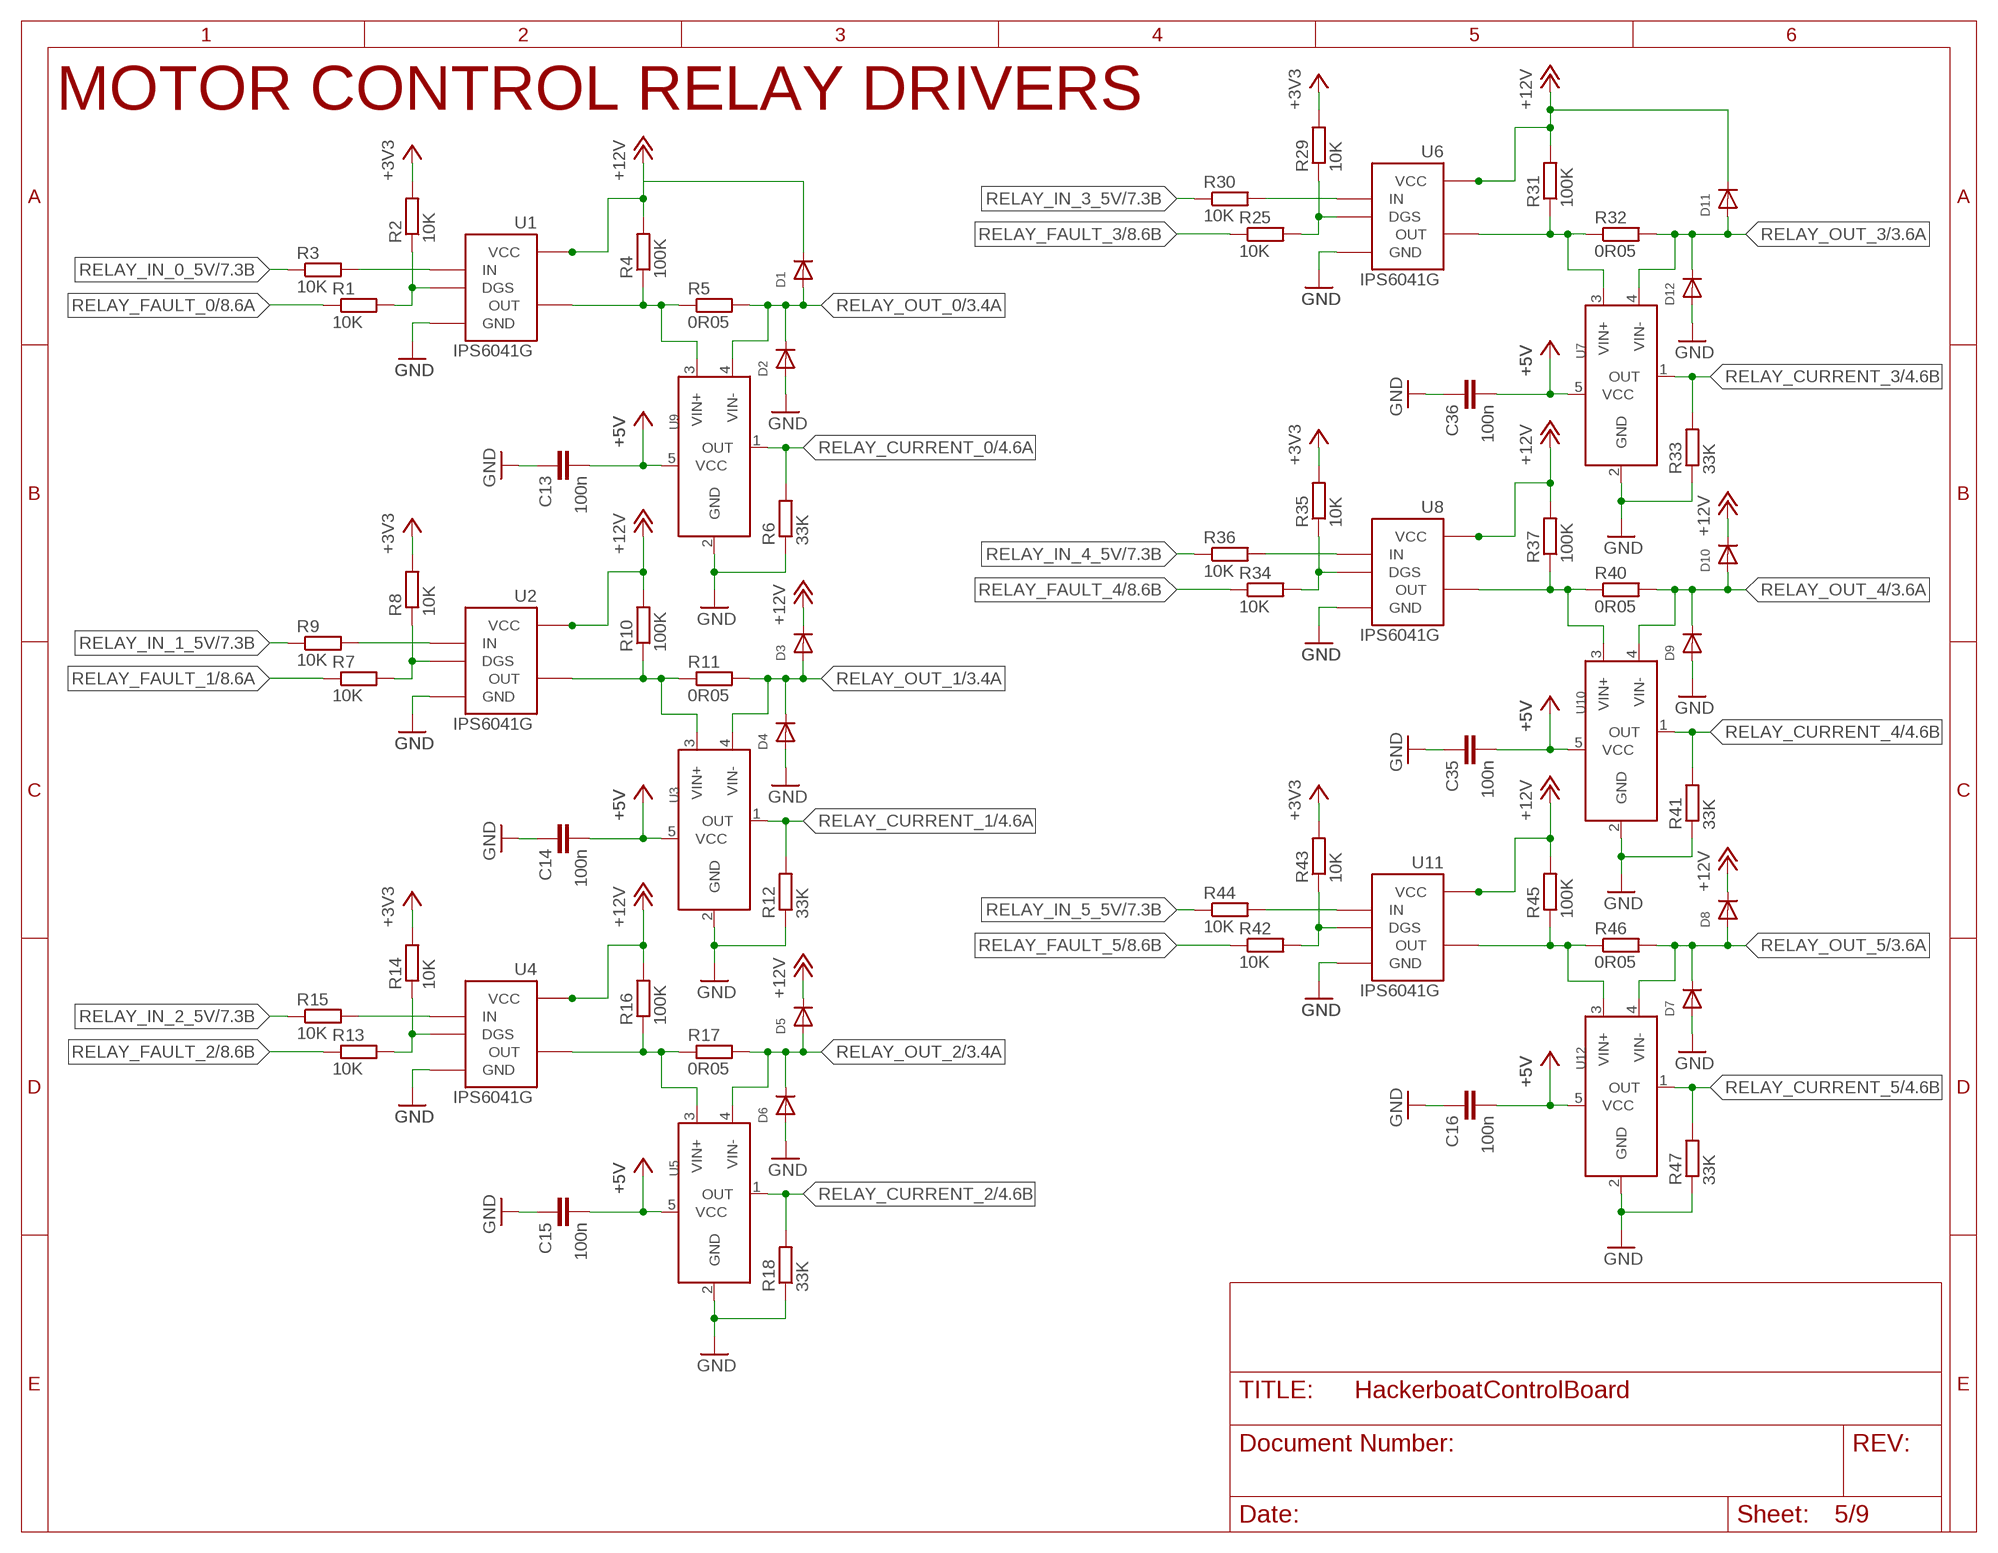
[diagram p4: schematic, sheet 5]

### Parts
C13  100n  C-EUC0603  [C0603]
C14  100n  C-EUC0603  [C0603]
C15  100n  C-EUC0603  [C0603]
C16  100n  C-EUC0603  [C0603]
C35  100n  C-EUC0603  [C0603]
C36  100n  C-EUC0603  [C0603]
D1  DIODESOD-123  [SOD-123]
D2  DIODESOD-123  [SOD-123]
D3  DIODESOD-123  [SOD-123]
D4  DIODESOD-123  [SOD-123]
D5  DIODESOD-123  [SOD-123]
D6  DIODESOD-123  [SOD-123]
D7  DIODESOD-123  [SOD-123]
D8  DIODESOD-123  [SOD-123]
D9  DIODESOD-123  [SOD-123]
D10  DIODESOD-123  [SOD-123]
D11  DIODESOD-123  [SOD-123]
D12  DIODESOD-123  [SOD-123]
R1  10K  R-EU_R0603  [R0603]
R2  10K  R-EU_R0603  [R0603]
R3  10K  R-EU_R0603  [R0603]
R4  100K  R-EU_R0603  [R0603]
R5  0R05  R-EU_R2512  [R2512]
R6  33K  R-EU_R0603  [R0603]
R7  10K  R-EU_R0603  [R0603]
R8  10K  R-EU_R0603  [R0603]
R9  10K  R-EU_R0603  [R0603]
R10  100K  R-EU_R0603  [R0603]
R11  0R05  R-EU_R2512  [R2512]
R12  33K  R-EU_R0603  [R0603]
R13  10K  R-EU_R0603  [R0603]
R14  10K  R-EU_R0603  [R0603]
R15  10K  R-EU_R0603  [R0603]
R16  100K  R-EU_R0603  [R0603]
R17  0R05  R-EU_R2512  [R2512]
R18  33K  R-EU_R0603  [R0603]
R25  10K  R-EU_R0603  [R0603]
R29  10K  R-EU_R0603  [R0603]
R30  10K  R-EU_R0603  [R0603]
R31  100K  R-EU_R0603  [R0603]
R32  0R05  R-EU_R2512  [R2512]
R33  33K  R-EU_R0603  [R0603]
R34  10K  R-EU_R0603  [R0603]
R35  10K  R-EU_R0603  [R0603]
R36  10K  R-EU_R0603  [R0603]
R37  100K  R-EU_R0603  [R0603]
R40  0R05  R-EU_R2512  [R2512]
R41  33K  R-EU_R0603  [R0603]
R42  10K  R-EU_R0603  [R0603]
R43  10K  R-EU_R0603  [R0603]
R44  10K  R-EU_R0603  [R0603]
R45  100K  R-EU_R0603  [R0603]
R46  0R05  R-EU_R2512  [R2512]
R47  33K  R-EU_R0603  [R0603]
U1  IPS6041G  [SO08]
U2  IPS6041G  [SO08]
U3  INA169  [SOT23-5L]
U4  IPS6041G  [SO08]
U5  INA169  [SOT23-5L]
U6  IPS6041G  [SO08]
U7  INA169  [SOT23-5L]
U8  IPS6041G  [SO08]
U9  INA169  [SOT23-5L]
U10  INA169  [SOT23-5L]
U11  IPS6041G  [SO08]
U12  INA169  [SOT23-5L]

### Nets
+3V3: R2.2 R8.2 R14.2 R29.2 R35.2 R43.2 ; also sheet 1,3,4,6,7,8,9
+5V: C13.2 C14.2 C15.2 C16.2 C35.2 C36.2 U3.5(VCC) U5.5(VCC) U7.5(VCC) U9.5(VCC) U10.5(VCC) U12.5(VCC) ; also sheet 1,2,3,4,6,7,8,9
+12V: D1.C D3.C D5.C D8.C D10.C D11.C R4.2 R10.2 R16.2 R31.2 R37.2 R45.2 U1.5(VCC) U1.6(VCC) U1.7(VCC) U1.8(VCC) U2.5(VCC) U2.6(VCC) U2.7(VCC) U2.8(VCC) U4.5(VCC) U4.6(VCC) U4.7(VCC) U4.8(VCC) U6.5(VCC) U6.6(VCC) U6.7(VCC) U6.8(VCC) U8.5(VCC) U8.6(VCC) U8.7(VCC) U8.8(VCC) U11.5(VCC) U11.6(VCC) U11.7(VCC) U11.8(VCC) ; also sheet 2,3,6,9
GND: C13.1 C14.1 C15.1 C16.1 C35.1 C36.1 D2.A D4.A D6.A D7.A D9.A D12.A R6.1 R12.1 R18.1 R33.1 R41.1 R47.1 U1.1(GND) U2.1(GND) U3.2(GND) U4.1(GND) U5.2(GND) U6.1(GND) U7.2(GND) U8.1(GND) U9.2(GND) U10.2(GND) U11.1(GND) U12.2(GND) ; also sheet 1,2,3,4,6,7,8,9
N$1: R1.2 R2.1 U1.3(DGS)
N$2: R3.2 U1.2(IN)
N$3: R4.1 R5.1 U1.4(OUT) U9.3(VIN+)
N$4: R7.2 R8.1 U2.3(DGS)
N$5: R9.2 U2.2(IN)
N$6: R10.1 R11.1 U2.4(OUT) U3.3(VIN+)
N$7: R13.2 R14.1 U4.3(DGS)
N$8: R15.2 U4.2(IN)
N$9: R16.1 R17.1 U4.4(OUT) U5.3(VIN+)
N$10: R25.2 R29.1 U6.3(DGS)
N$11: R30.2 U6.2(IN)
N$12: R31.1 R32.1 U6.4(OUT) U7.3(VIN+)
N$13: R34.2 R35.1 U8.3(DGS)
N$14: R36.2 U8.2(IN)
N$15: R37.1 R40.1 U8.4(OUT) U10.3(VIN+)
N$16: R42.2 R43.1 U11.3(DGS)
N$17: R44.2 U11.2(IN)
N$18: R45.1 R46.1 U11.4(OUT) U12.3(VIN+)
RELAY_CURRENT_0: R6.2 U9.1(OUT) ; also sheet 4
RELAY_CURRENT_1: R12.2 U3.1(OUT) ; also sheet 4
RELAY_CURRENT_2: R18.2 U5.1(OUT) ; also sheet 4
RELAY_CURRENT_3: R33.2 U7.1(OUT) ; also sheet 4
RELAY_CURRENT_4: R41.2 U10.1(OUT) ; also sheet 4
RELAY_CURRENT_5: R47.2 U12.1(OUT) ; also sheet 4
RELAY_FAULT_0: R1.1 ; also sheet 1,8
RELAY_FAULT_1: R7.1 ; also sheet 1,8
RELAY_FAULT_2: R13.1 ; also sheet 1,8
RELAY_FAULT_3: R25.1 ; also sheet 1,8
RELAY_FAULT_4: R34.1 ; also sheet 1,8
RELAY_FAULT_5: R42.1 ; also sheet 1,8
RELAY_IN_0_5V: R3.1 ; also sheet 7
RELAY_IN_1_5V: R9.1 ; also sheet 7
RELAY_IN_2_5V: R15.1 ; also sheet 7
RELAY_IN_3_5V: R30.1 ; also sheet 7
RELAY_IN_4_5V: R36.1 ; also sheet 7
RELAY_IN_5_5V: R44.1 ; also sheet 7
RELAY_OUT_0: D1.A D2.C R5.2 U9.4(VIN-) ; also sheet 3
RELAY_OUT_1: D3.A D4.C R11.2 U3.4(VIN-) ; also sheet 3
RELAY_OUT_2: D5.A D6.C R17.2 U5.4(VIN-) ; also sheet 3
RELAY_OUT_3: D11.A D12.C R32.2 U7.4(VIN-) ; also sheet 3
RELAY_OUT_4: D9.C D10.A R40.2 U10.4(VIN-) ; also sheet 3
RELAY_OUT_5: D7.C D8.A R46.2 U12.4(VIN-) ; also sheet 3

### Notes on the sheet
- MOTOR CONTROL RELAY DRIVERS

## Sheet 6 of 9
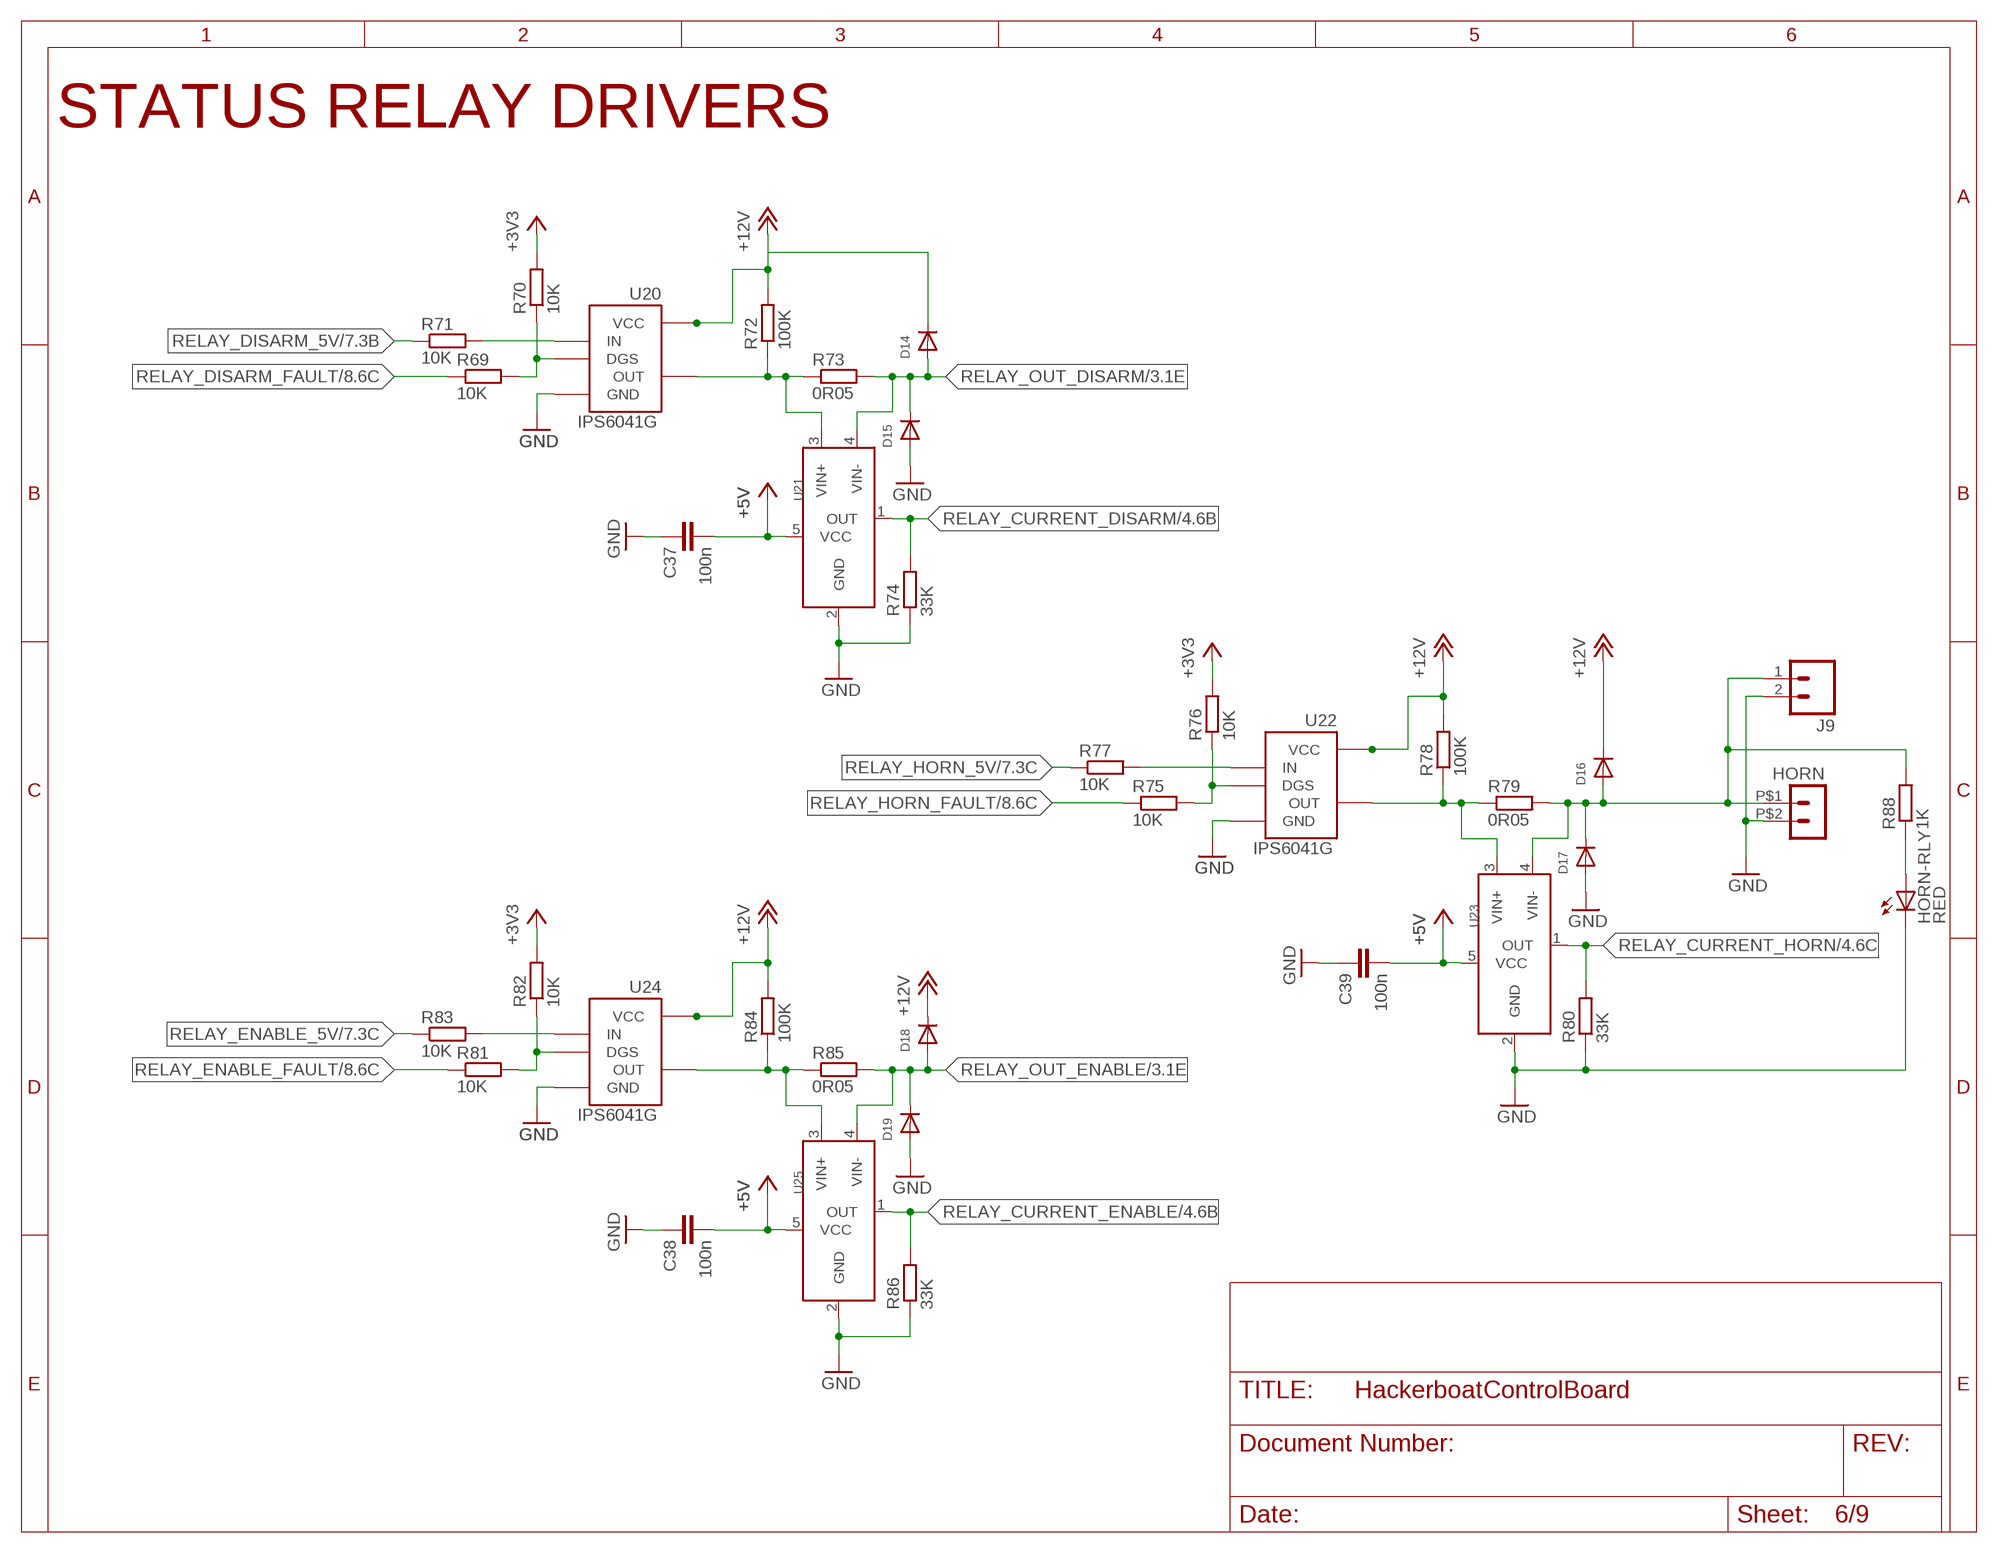
[diagram p5: schematic, sheet 6]

### Parts
C37  100n  C-EUC0603  [C0603]
C38  100n  C-EUC0603  [C0603]
C39  100n  C-EUC0603  [C0603]
D14  DIODESOD-123  [SOD-123]
D15  DIODESOD-123  [SOD-123]
D16  DIODESOD-123  [SOD-123]
D17  DIODESOD-123  [SOD-123]
D18  DIODESOD-123  [SOD-123]
D19  DIODESOD-123  [SOD-123]
HORN  HEADER_POS2_70555  [70555-POS2]
HORN-RLY  RED  LEDCHIPLED_0805  [CHIPLED_0805]
J9  M02LOCK  [1X02_LOCK]
R69  10K  R-EU_R0603  [R0603]
R70  10K  R-EU_R0603  [R0603]
R71  10K  R-EU_R0603  [R0603]
R72  100K  R-EU_R0603  [R0603]
R73  0R05  R-EU_R2512  [R2512]
R74  33K  R-EU_R0603  [R0603]
R75  10K  R-EU_R0603  [R0603]
R76  10K  R-EU_R0603  [R0603]
R77  10K  R-EU_R0603  [R0603]
R78  100K  R-EU_R0603  [R0603]
R79  0R05  R-EU_R2512  [R2512]
R80  33K  R-EU_R0603  [R0603]
R81  10K  R-EU_R0603  [R0603]
R82  10K  R-EU_R0603  [R0603]
R83  10K  R-EU_R0603  [R0603]
R84  100K  R-EU_R0603  [R0603]
R85  0R05  R-EU_R2512  [R2512]
R86  33K  R-EU_R0603  [R0603]
R88  1K  R-EU_R0603  [R0603]
U20  IPS6041G  [SO08]
U21  INA169  [SOT23-5L]
U22  IPS6041G  [SO08]
U23  INA169  [SOT23-5L]
U24  IPS6041G  [SO08]
U25  INA169  [SOT23-5L]

### Nets
+3V3: R70.2 R76.2 R82.2 ; also sheet 1,3,4,5,7,8,9
+5V: C37.2 C38.2 C39.2 U21.5(VCC) U23.5(VCC) U25.5(VCC) ; also sheet 1,2,3,4,5,7,8,9
+12V: D14.C D16.C D18.C R72.2 R78.2 R84.2 U20.5(VCC) U20.6(VCC) U20.7(VCC) U20.8(VCC) U22.5(VCC) U22.6(VCC) U22.7(VCC) U22.8(VCC) U24.5(VCC) U24.6(VCC) U24.7(VCC) U24.8(VCC) ; also sheet 2,3,5,9
GND: C37.1 C38.1 C39.1 D15.A D17.A D19.A HORN-RLY.C HORN.P$2 J9.2 R74.1 R80.1 R86.1 U20.1(GND) U21.2(GND) U22.1(GND) U23.2(GND) U24.1(GND) U25.2(GND) ; also sheet 1,2,3,4,5,7,8,9
N$24: R69.2 R70.1 U20.3(DGS)
N$25: R71.2 U20.2(IN)
N$26: R72.1 R73.1 U20.4(OUT) U21.3(VIN+)
N$34: R75.2 R76.1 U22.3(DGS)
N$48: R77.2 U22.2(IN)
N$49: R78.1 R79.1 U22.4(OUT) U23.3(VIN+)
N$50: R81.2 R82.1 U24.3(DGS)
N$51: R83.2 U24.2(IN)
N$52: R84.1 R85.1 U24.4(OUT) U25.3(VIN+)
N$74: HORN-RLY.A R88.1
RELAY_CURRENT_DISARM: R74.2 U21.1(OUT) ; also sheet 4
RELAY_CURRENT_ENABLE: R86.2 U25.1(OUT) ; also sheet 4
RELAY_CURRENT_HORN: R80.2 U23.1(OUT) ; also sheet 4
RELAY_DISARM_5V: R71.1 ; also sheet 7
RELAY_DISARM_FAULT: R69.1 ; also sheet 1,8
RELAY_ENABLE_5V: R83.1 ; also sheet 7
RELAY_ENABLE_FAULT: R81.1 ; also sheet 1,8
RELAY_HORN_5V: R77.1 ; also sheet 7
RELAY_HORN_FAULT: R75.1 ; also sheet 1,8
RELAY_OUT_DISARM: D14.A D15.C R73.2 U21.4(VIN-) ; also sheet 3
RELAY_OUT_ENABLE: D18.A D19.C R85.2 U25.4(VIN-) ; also sheet 3
RELAY_OUT_HORN: D16.A D17.C HORN.P$1 J9.1 R79.2 R88.2 U23.4(VIN-)

### Notes on the sheet
- STATUS RELAY DRIVERS

## Sheet 7 of 9
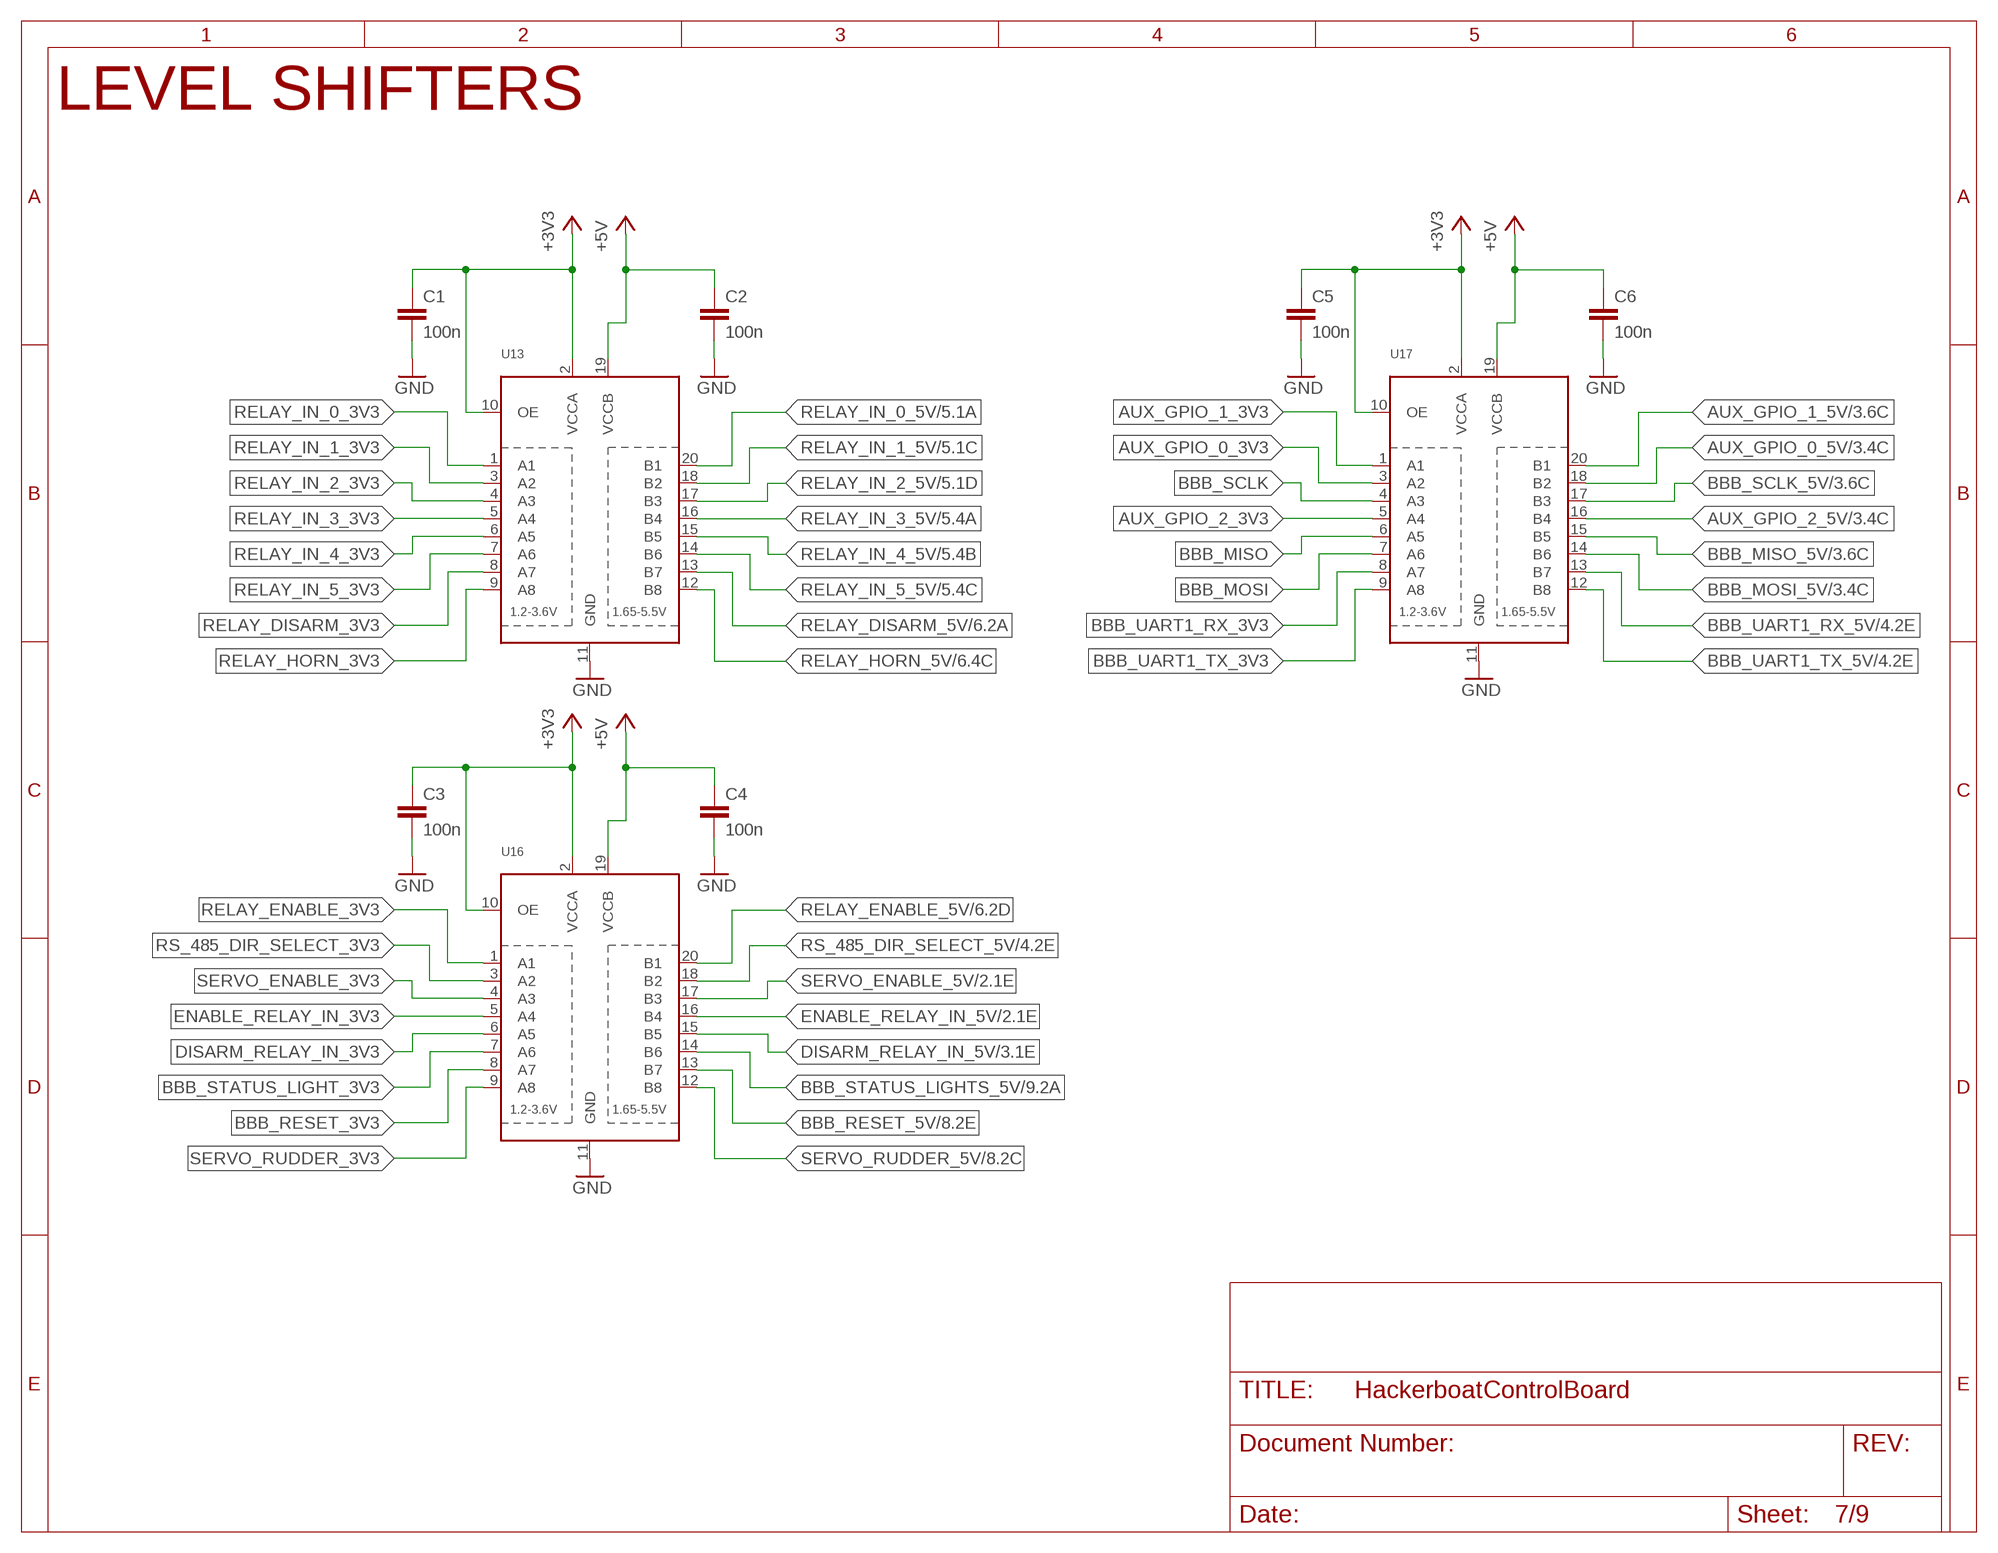
[diagram p6: schematic, sheet 7]

### Parts
C1  100n  C-EUC0603  [C0603]
C2  100n  C-EUC0603  [C0603]
C3  100n  C-EUC0603  [C0603]
C4  100n  C-EUC0603  [C0603]
C5  100n  C-EUC0603  [C0603]
C6  100n  C-EUC0603  [C0603]
U13  TXB0108PWR  [TSSOP20]
U16  TXB0108PWR  [TSSOP20]
U17  TXB0108PWR  [TSSOP20]

### Nets
+3V3: C1.1 C3.1 C5.1 U13.2(VCCA) U13.10(OE) U16.2(VCCA) U16.10(OE) U17.2(VCCA) U17.10(OE) ; also sheet 1,3,4,5,6,8,9
+5V: C2.1 C4.1 C6.1 U13.19(VCCB) U16.19(VCCB) U17.19(VCCB) ; also sheet 1,2,3,4,5,6,8,9
AUX_GPIO_0_3V3: U17.3(A2) ; also sheet 1
AUX_GPIO_0_5V: U17.18(B2) ; also sheet 3
AUX_GPIO_1_3V3: U17.1(A1) ; also sheet 1
AUX_GPIO_1_5V: U17.20(B1) ; also sheet 3
AUX_GPIO_2_3V3: U17.5(A4) ; also sheet 1
AUX_GPIO_2_5V: U17.16(B4) ; also sheet 3
BBB_MISO: U17.6(A5) ; also sheet 1
BBB_MISO_5V: U17.15(B5) ; also sheet 3
BBB_MOSI: U17.7(A6) ; also sheet 1
BBB_MOSI_5V: U17.14(B6) ; also sheet 3
BBB_RESET_3V3: U16.8(A7) ; also sheet 1
BBB_RESET_5V: U16.13(B7) ; also sheet 8
BBB_SCLK: U17.4(A3) ; also sheet 1
BBB_SCLK_5V: U17.17(B3) ; also sheet 3
BBB_STATUS_LIGHT_3V3: U16.7(A6)
BBB_STATUS_LIGHTS_5V: U16.14(B6) ; also sheet 9
BBB_UART1_RX_3V3: U17.8(A7) ; also sheet 1
BBB_UART1_RX_5V: U17.13(B7) ; also sheet 4
BBB_UART1_TX_3V3: U17.9(A8) ; also sheet 1
BBB_UART1_TX_5V: U17.12(B8) ; also sheet 4
DISARM_RELAY_IN_3V3: U16.6(A5) ; also sheet 1
DISARM_RELAY_IN_5V: U16.15(B5) ; also sheet 3
ENABLE_RELAY_IN_3V3: U16.5(A4) ; also sheet 1
ENABLE_RELAY_IN_5V: U16.16(B4) ; also sheet 2,3
GND: C1.2 C2.2 C3.2 C4.2 C5.2 C6.2 U13.11(GND) U16.11(GND) U17.11(GND) ; also sheet 1,2,3,4,5,6,8,9
RELAY_DISARM_3V3: U13.8(A7) ; also sheet 1
RELAY_DISARM_5V: U13.13(B7) ; also sheet 6
RELAY_ENABLE_3V3: U16.1(A1) ; also sheet 1
RELAY_ENABLE_5V: U16.20(B1) ; also sheet 6
RELAY_HORN_3V3: U13.9(A8) ; also sheet 1
RELAY_HORN_5V: U13.12(B8) ; also sheet 6
RELAY_IN_0_3V3: U13.1(A1) ; also sheet 1
RELAY_IN_0_5V: U13.20(B1) ; also sheet 5
RELAY_IN_1_3V3: U13.3(A2) ; also sheet 1
RELAY_IN_1_5V: U13.18(B2) ; also sheet 5
RELAY_IN_2_3V3: U13.4(A3) ; also sheet 1
RELAY_IN_2_5V: U13.17(B3) ; also sheet 5
RELAY_IN_3_3V3: U13.5(A4) ; also sheet 1
RELAY_IN_3_5V: U13.16(B4) ; also sheet 5
RELAY_IN_4_3V3: U13.6(A5) ; also sheet 1
RELAY_IN_4_5V: U13.15(B5) ; also sheet 5
RELAY_IN_5_3V3: U13.7(A6) ; also sheet 1
RELAY_IN_5_5V: U13.14(B6) ; also sheet 5
RS_485_DIR_SELECT_3V3: U16.3(A2) ; also sheet 1
RS_485_DIR_SELECT_5V: U16.18(B2) ; also sheet 4
SERVO_ENABLE_3V3: U16.4(A3) ; also sheet 1
SERVO_ENABLE_5V: U16.17(B3) ; also sheet 2
SERVO_RUDDER_3V3: U16.9(A8) ; also sheet 1
SERVO_RUDDER_5V: U16.12(B8) ; also sheet 8

### Notes on the sheet
- LEVEL SHIFTERS

## Sheet 8 of 9
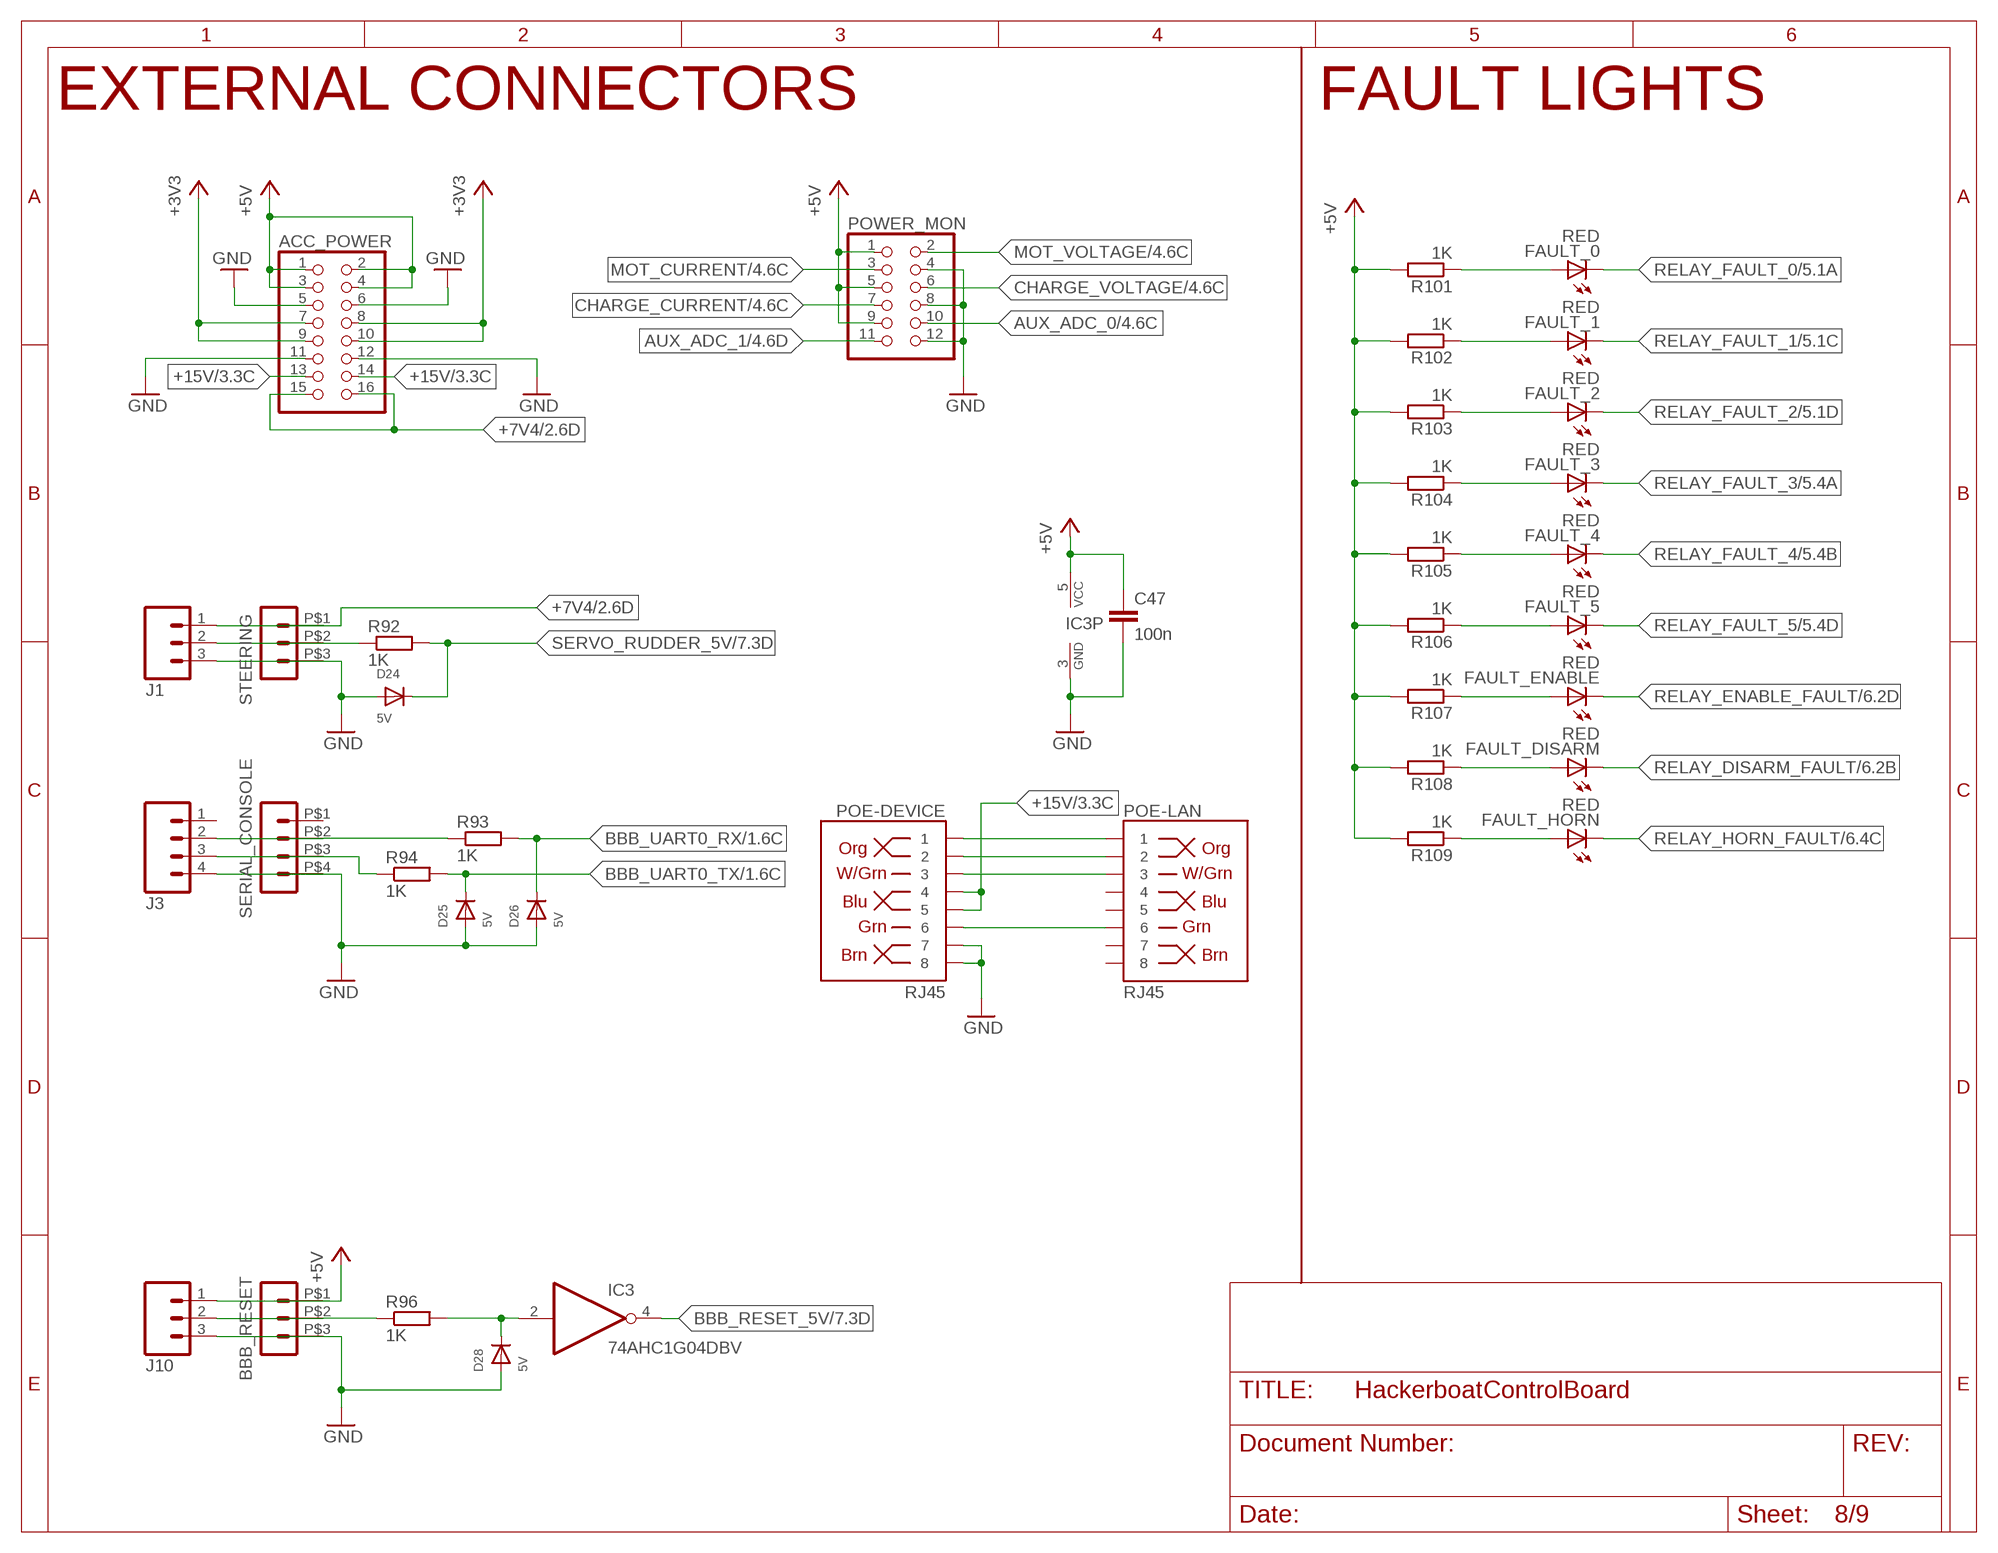
[diagram p7: schematic, sheet 8]

### Parts
ACC_POWER  PINHD-2X8_2.54  [2X08]
BBB_RESET  HEADER_POS3_70555  [70555-POS3]
C47  100n  C-EUC0603  [C0603]
D24  5V  DIODESOD-123  [SOD-123]
D25  5V  DIODESOD-123  [SOD-123]
D26  5V  DIODESOD-123  [SOD-123]
D28  5V  DIODESOD-123  [SOD-123]
FAULT_0  RED  LEDCHIPLED_0805  [CHIPLED_0805]
FAULT_1  RED  LEDCHIPLED_0805  [CHIPLED_0805]
FAULT_2  RED  LEDCHIPLED_0805  [CHIPLED_0805]
FAULT_3  RED  LEDCHIPLED_0805  [CHIPLED_0805]
FAULT_4  RED  LEDCHIPLED_0805  [CHIPLED_0805]
FAULT_5  RED  LEDCHIPLED_0805  [CHIPLED_0805]
FAULT_DISARM  RED  LEDCHIPLED_0805  [CHIPLED_0805]
FAULT_ENABLE  RED  LEDCHIPLED_0805  [CHIPLED_0805]
FAULT_HORN  RED  LEDCHIPLED_0805  [CHIPLED_0805]
IC3  74AHC1G04DBV  [SOT23-5]
J1  M03LOCK  [1X03_LOCK]
J3  M04LOCK  [1X04_LOCK]
J10  M03LOCK  [1X03_LOCK]
POE-DEVICE  RJ45  RJ45-8PTH  [RJ45-8]
POE-LAN  RJ45  RJ45-8PTH  [RJ45-8]
POWER_MON  PINHD-2X6_2.54  [2X06]
R92  1K  R-EU_R0603  [R0603]
R93  1K  R-EU_R0603  [R0603]
R94  1K  R-EU_R0603  [R0603]
R96  1K  R-EU_R0603  [R0603]
R101  1K  R-EU_R0603  [R0603]
R102  1K  R-EU_R0603  [R0603]
R103  1K  R-EU_R0603  [R0603]
R104  1K  R-EU_R0603  [R0603]
R105  1K  R-EU_R0603  [R0603]
R106  1K  R-EU_R0603  [R0603]
R107  1K  R-EU_R0603  [R0603]
R108  1K  R-EU_R0603  [R0603]
R109  1K  R-EU_R0603  [R0603]
SERIAL_CONSOLE  HEADER_POS4_70555  [70555-POS4]
STEERING  HEADER_POS3_70555  [70555-POS3]

### Nets
+3V3: ACC_POWER.7 ACC_POWER.8 ACC_POWER.9 ACC_POWER.10 ; also sheet 1,3,4,5,6,7,9
+5V: ACC_POWER.1 ACC_POWER.2 ACC_POWER.3 ACC_POWER.4 BBB_RESET.P$1 C47.1 IC3.5(VCC) J10.1 POWER_MON.1 POWER_MON.5 POWER_MON.9 R101.2 R102.2 R103.2 R104.2 R105.2 R106.2 R107.2 R108.2 R109.2 ; also sheet 1,2,3,4,5,6,7,9
+7V4: ACC_POWER.15 ACC_POWER.16 J1.1 STEERING.P$1 ; also sheet 2
+15V: ACC_POWER.13 ACC_POWER.14 POE-DEVICE.4 POE-DEVICE.5 ; also sheet 3
AUX_ADC_0: POWER_MON.10 ; also sheet 4
AUX_ADC_1: POWER_MON.11 ; also sheet 4
BBB_RESET_5V: IC3.4(O) ; also sheet 7
BBB_UART0_RX: D26.C R93.2 ; also sheet 1
BBB_UART0_TX: D25.C R94.2 ; also sheet 1
CHARGE_CURRENT: POWER_MON.7 ; also sheet 4
CHARGE_VOLTAGE: POWER_MON.6 ; also sheet 4
GND: ACC_POWER.5 ACC_POWER.6 ACC_POWER.11 ACC_POWER.12 BBB_RESET.P$3 C47.2 D24.A D25.A D26.A D28.A IC3.3(GND) J1.3 J3.4 J10.3 POE-DEVICE.7 POE-DEVICE.8 POWER_MON.4 POWER_MON.8 POWER_MON.12 SERIAL_CONSOLE.P$4 STEERING.P$3 ; also sheet 1,2,3,4,5,6,7,9
MOT_CURRENT: POWER_MON.3 ; also sheet 4
MOT_VOLTAGE: POWER_MON.2 ; also sheet 4
N$23: D28.C IC3.2(I) R96.2
N$43: POE-DEVICE.1 POE-LAN.1
N$44: POE-DEVICE.2 POE-LAN.2
N$45: POE-DEVICE.3 POE-LAN.3
N$54: POE-DEVICE.6 POE-LAN.6
N$89: J1.2 R92.1 STEERING.P$2
N$90: J3.2 R93.1 SERIAL_CONSOLE.P$2
N$91: J3.3 R94.1 SERIAL_CONSOLE.P$3
N$93: BBB_RESET.P$2 J10.2 R96.1
N$100: FAULT_0.A R101.1
N$101: FAULT_1.A R102.1
N$102: FAULT_2.A R103.1
N$103: FAULT_3.A R104.1
N$105: FAULT_4.A R105.1
N$109: FAULT_5.A R106.1
N$110: FAULT_ENABLE.A R107.1
N$111: FAULT_DISARM.A R108.1
N$112: FAULT_HORN.A R109.1
RELAY_DISARM_FAULT: FAULT_DISARM.C ; also sheet 1,6
RELAY_ENABLE_FAULT: FAULT_ENABLE.C ; also sheet 1,6
RELAY_FAULT_0: FAULT_0.C ; also sheet 1,5
RELAY_FAULT_1: FAULT_1.C ; also sheet 1,5
RELAY_FAULT_2: FAULT_2.C ; also sheet 1,5
RELAY_FAULT_3: FAULT_3.C ; also sheet 1,5
RELAY_FAULT_4: FAULT_4.C ; also sheet 1,5
RELAY_FAULT_5: FAULT_5.C ; also sheet 1,5
RELAY_HORN_FAULT: FAULT_HORN.C ; also sheet 1,6
SERVO_RUDDER_5V: D24.C R92.2 ; also sheet 7
Unconnected: J3.1 POE-LAN.4 POE-LAN.5 POE-LAN.7 POE-LAN.8 SERIAL_CONSOLE.P$1

### Notes on the sheet
- EXTERNAL CONNECTORS | FAULT LIGHTS

## Sheet 9 of 9
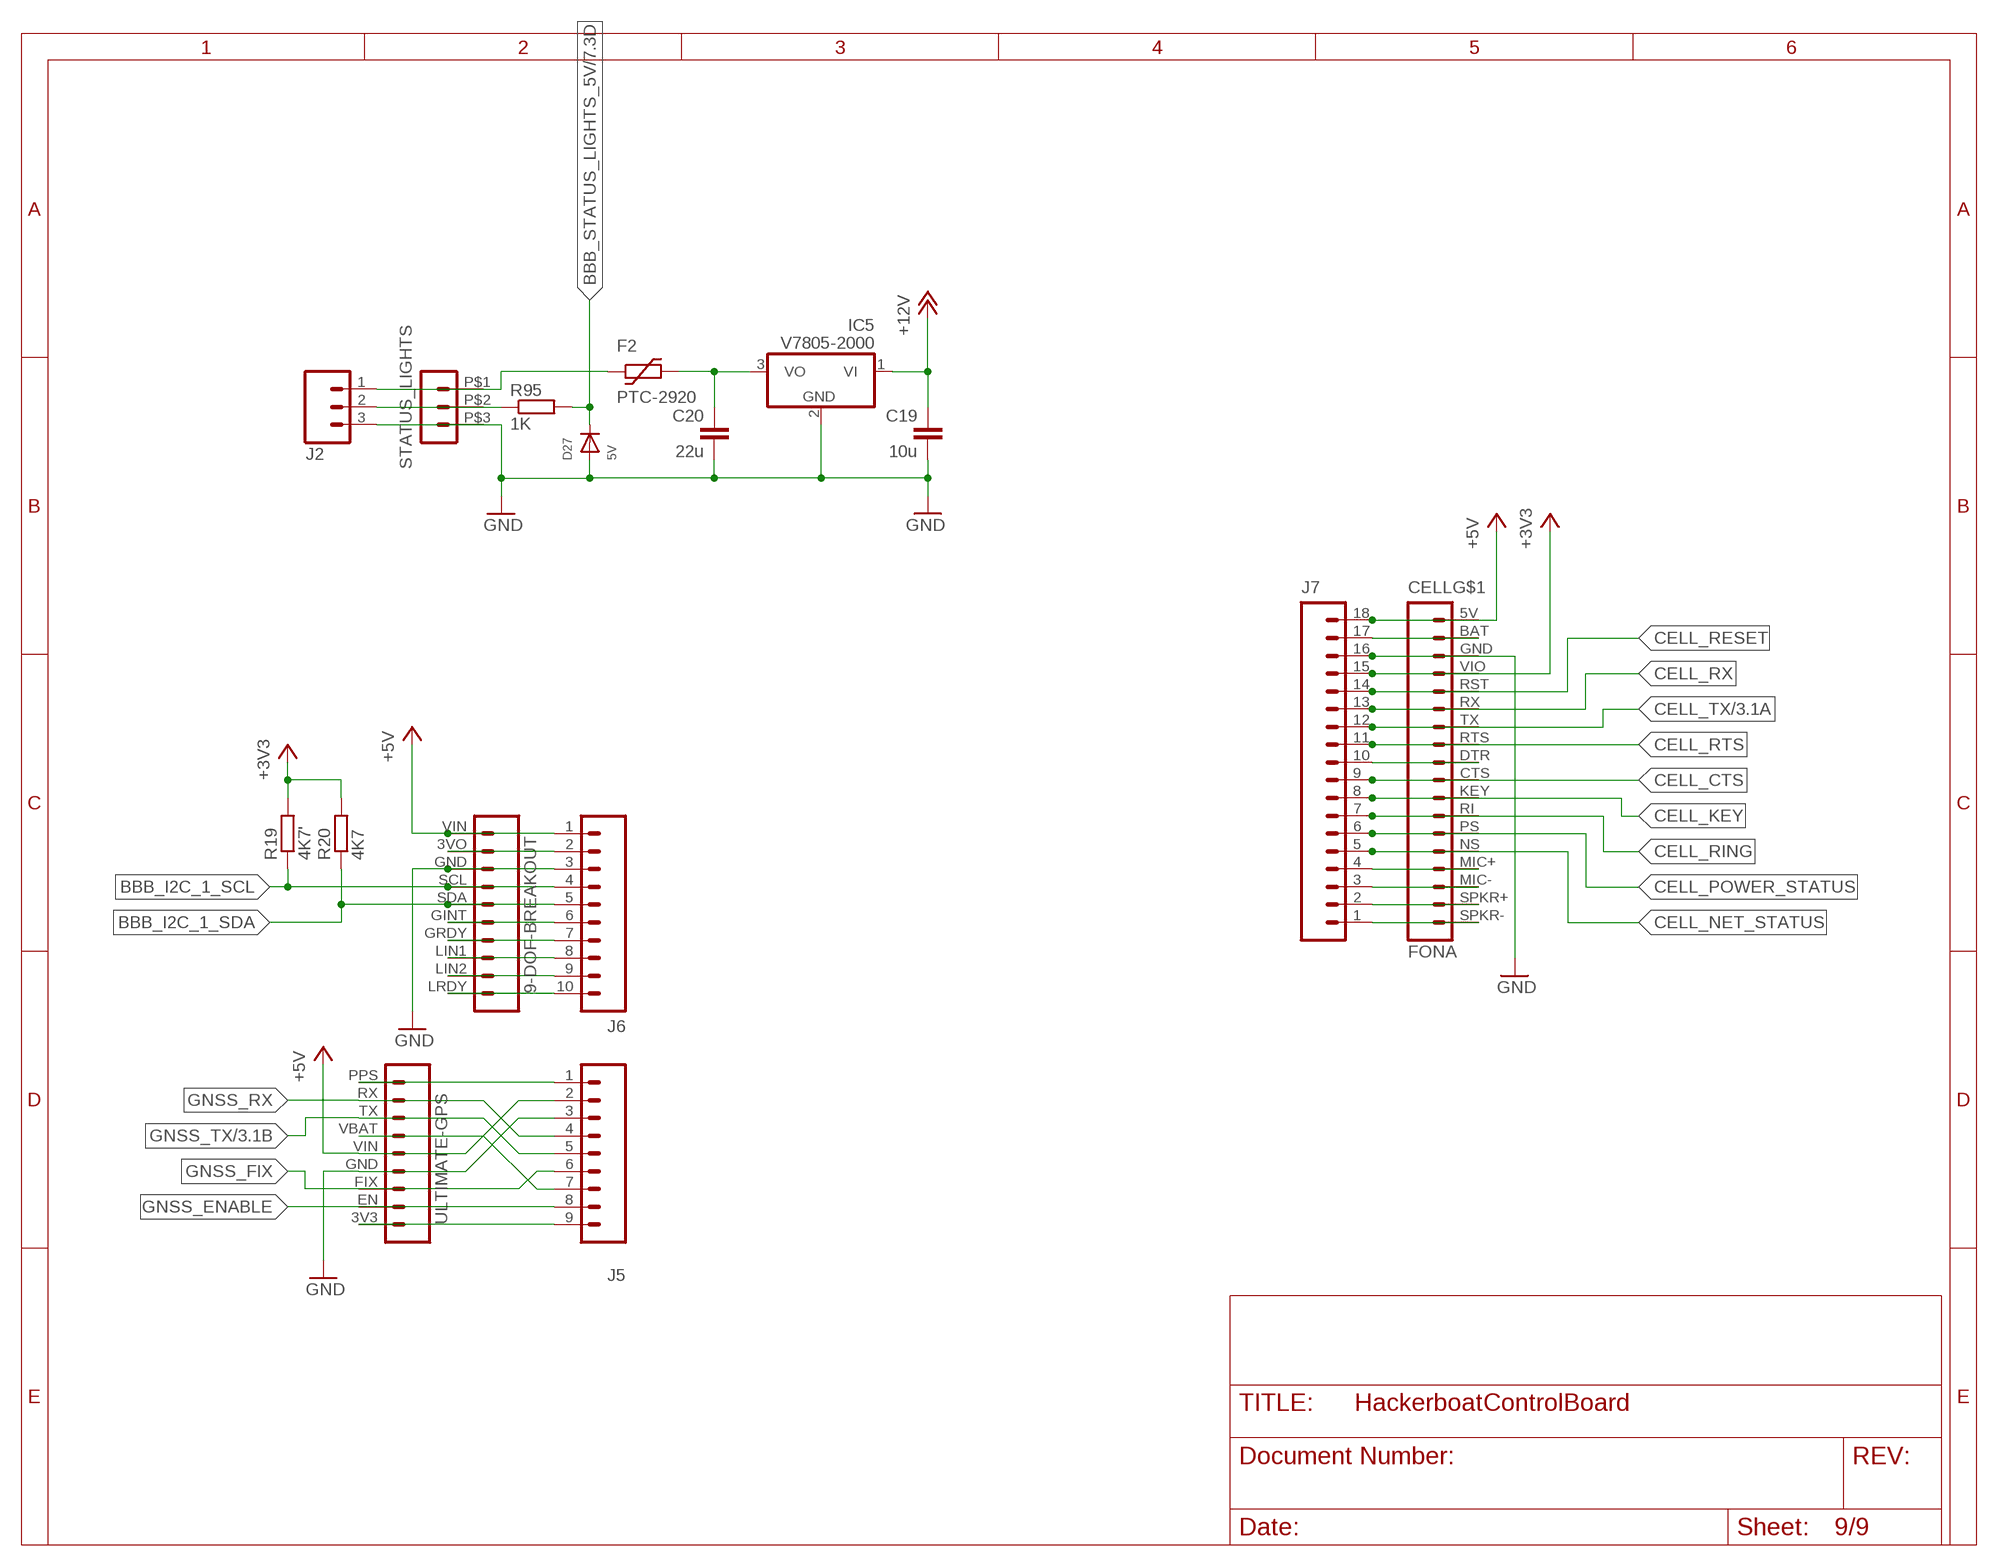
[diagram p8: schematic, sheet 9]

### Parts
C19  10u  C-EUC1210  [C1210]
C20  22u  C-EUC1210  [C1210]
D27  5V  DIODESOD-123  [SOD-123]
F2  PTC-2920  [2920L]
IC5  V7805-2000  7805TV  [TO220V]
J2  M03LOCK  [1X03_LOCK]
J5  M09LOCK  [1X09_LOCK]
J6  M10LOCK  [1X10_LOCK]
J7  M18_  [1X18]
R19  4K7'  R-EU_R0603  [R0603]
R20  4K7  R-EU_R0603  [R0603]
R95  1K  R-EU_R0603  [R0603]
STATUS_LIGHTS  HEADER_POS3_70555  [70555-POS3]

### Nets
+3V3: CELL.VIO J7.15 R19.2 R20.2 ; also sheet 1,3,4,5,6,7,8
+5V: CELL.5V GPS.VIN IMU.VIN J5.2 J6.1 J7.18 ; also sheet 1,2,3,4,5,6,7,8
+12V: C19.1 IC5.1(VI) ; also sheet 2,3,5,6
BBB_I2C_1_SCL: IMU.SCL J6.4 R19.1 ; also sheet 1
BBB_I2C_1_SDA: IMU.SDA J6.5 R20.1 ; also sheet 1
BBB_STATUS_LIGHTS_5V: D27.C R95.2 ; also sheet 7
CELL_CTS: CELL.CTS J7.9 ; also sheet 1
CELL_KEY: CELL.KEY J7.8 ; also sheet 1
CELL_NET_STATUS: CELL.NS J7.5 ; also sheet 1
CELL_POWER_STATUS: CELL.PS J7.6 ; also sheet 1
CELL_RESET: CELL.RST J7.14 ; also sheet 1
CELL_RING: CELL.RI J7.7 ; also sheet 1
CELL_RTS: CELL.RTS J7.11 ; also sheet 1
CELL_RX: CELL.RX J7.13 ; also sheet 1
CELL_TX: CELL.TX J7.12 ; also sheet 1,3
GND: C19.2 C20.2 CELL.GND D27.A GPS.GND IC5.2(GND) IMU.GND J2.3 J5.3 J6.3 J7.16 STATUS_LIGHTS.P$3 ; also sheet 1,2,3,4,5,6,7,8
GNSS_ENABLE: GPS.EN J5.8 ; also sheet 1
GNSS_FIX: GPS.FIX J5.6 ; also sheet 1
GNSS_RX: GPS.RX J5.4 ; also sheet 1
GNSS_TX: GPS.TX J5.5 ; also sheet 1,3
N$19: GPS.PPS J5.1
N$20: GPS.VBAT J5.7
N$28: IMU.3VO J6.2
N$29: IMU.GINT J6.6
N$30: IMU.GRDY J6.7
N$31: IMU.LIN1 J6.8
N$32: IMU.LIN2 J6.9
N$33: IMU.LRDY J6.10
N$35: GPS.3V3 J5.9
N$37: CELL.SPKR+ J7.2
N$38: CELL.MIC- J7.3
N$39: CELL.MIC+ J7.4
N$40: CELL.DTR J7.10
N$41: CELL.BAT J7.17
N$42: CELL.SPKR- J7.1
N$62: F2.P$1 J2.1 STATUS_LIGHTS.P$1
N$68: C20.1 F2.P$2 IC5.3(VO)
N$92: J2.2 R95.1 STATUS_LIGHTS.P$2

## Library data of the parts
5V-STAT 7V4-STAT ENABLE PWR RLY0 RLY1-RLY5 = adafruit:LED: LED OSRAM: - CHIPLED LG R971, LG N971, LY N971, LG Q971, LY Q971, LO R971, LY R971 LH N974, LH R974 LS Q976, LO Q976, LY Q976 LO Q996 - Hyper CHIPLED LW Q18S LB Q993, LB Q99A, LB R99A - SideLED LS A670, LO A670, LY A670, LG A670, LP A670 LB A673, LV A673, LT A673, LW A673 LH A674 LY A675 LS A676, LA A676, LO A676, LY A676, LW A676 LS A679, LY A679, LG A679 - Hyper Micro SIDELED® LS Y876, LA Y876, LO Y876, LY Y876 LT Y87S - SmartLED LW L88C, LW L88S LB L89C, LB L89S, LG L890 LS L89K, LO L89K, LY L89K LS L896, LA L896, LO L896, LY L896 - TOPLED LS T670, LO T670, LY T670, LG T670, LP T670 LSG T670, LSP T670, LSY T670, LOP T670, LYG T670 LG T671, LOG T671, LSG T671 LB T673, LV T673, LT T673, LW T673 LH T674 LS T676, LA T676, LO T676, LY T676, LB T676, LH T676, LSB T676, LW T676 LB T67C, LV T67C, LT T67C, LS T67K, LO T67K, LY T67K, LW E67C LS E67B, LA E67B, LO E67B, LY E67B, LB E67C, LV E67C, LT E67C LW T67C LS T679, LY T679, LG T679 LS T770, LO T770, LY T770, LG T770, LP T770 LB T773, LV T773, LT T773, LW T773 LH T774 LS E675, LA E675, LY E675, LS T675 LS T776, LA T776, LO T776, LY T776, LB T776 LHGB T686 LT T68C, LB T68C - Hyper Mini TOPLED® LB M676 - Mini TOPLED Santana® LG M470 LS M47K, LO M47K, LY M47K Source: http://www.osram.convergy.de/; PARTNO: LG R971-KN-1
15V-ENB = jumper:SJ: SMD solder JUMPER; BOM: EXCLUDE; PARTNO: ?
ACC_POWER = pinhead-1:PINHD-2X8: PIN HEADER; PARTNO: *
AUX_GPIO = SparkFun-Connectors:M06X2; PARTNO: *; PROD_ID: CONN-12423
BBB_CONSOLE = SparkFun-Connectors:FTDI_BASIC: FTDI Basic header with labels; PARTNO: 215299-6
BBB_RESET RS485 STATUS_LIGHTS STEERING = con-molex-c-grid-sl:HEADER_POS3_?: Molex -C-Grid® / SL Series connector Wire-to-Board 2.54 mm (0.100") pitch header, 3 positions.; PARTNO: 0705550037
BLOWN FAULT_0 FAULT_1-FAULT_5 FAULT_DISARM FAULT_ENABLE FAULT_HORN HORN-RLY REV = adafruit:LED: LED OSRAM: - CHIPLED LG R971, LG N971, LY N971, LG Q971, LY Q971, LO R971, LY R971 LH N974, LH R974 LS Q976, LO Q976, LY Q976 LO Q996 - Hyper CHIPLED LW Q18S LB Q993, LB Q99A, LB R99A - SideLED LS A670, LO A670, LY A670, LG A670, LP A670 LB A673, LV A673, LT A673, LW A673 LH A674 LY A675 LS A676, LA A676, LO A676, LY A676, LW A676 LS A679, LY A679, LG A679 - Hyper Micro SIDELED® LS Y876, LA Y876, LO Y876, LY Y876 LT Y87S - SmartLED LW L88C, LW L88S LB L89C, LB L89S, LG L890 LS L89K, LO L89K, LY L89K LS L896, LA L896, LO L896, LY L896 - TOPLED LS T670, LO T670, LY T670, LG T670, LP T670 LSG T670, LSP T670, LSY T670, LOP T670, LYG T670 LG T671, LOG T671, LSG T671 LB T673, LV T673, LT T673, LW T673 LH T674 LS T676, LA T676, LO T676, LY T676, LB T676, LH T676, LSB T676, LW T676 LB T67C, LV T67C, LT T67C, LS T67K, LO T67K, LY T67K, LW E67C LS E67B, LA E67B, LO E67B, LY E67B, LB E67C, LV E67C, LT E67C LW T67C LS T679, LY T679, LG T679 LS T770, LO T770, LY T770, LG T770, LP T770 LB T773, LV T773, LT T773, LW T773 LH T774 LS E675, LA E675, LY E675, LS T675 LS T776, LA T776, LO T776, LY T776, LB T776 LHGB T686 LT T68C, LB T68C - Hyper Mini TOPLED® LB M676 - Mini TOPLED Santana® LG M470 LS M47K, LO M47K, LY M47K Source: http://www.osram.convergy.de/; PARTNO: LH R974-LP-1
C1-C16 C32 C35-C40 C47 C48 = resistor:C-EU: CAPACITOR, European symbol; PARTNO: CC0603KRX7R9BB104
C17 C19 C28 C29 = resistor:C-EU: CAPACITOR, European symbol; PARTNO: UMK325BJ106MM
C18 C20 = resistor:C-EU: CAPACITOR, European symbol; PARTNO: GRM32ER61E226KE15K
C26 C27 C43 C44 = resistor:C-EU: CAPACITOR, European symbol; PARTNO: UMK325F475ZH
C30 = resistor:C-EU: CAPACITOR, European symbol; PARTNO: CL10B103KB8NCNC
C31 = resistor:C-EU: CAPACITOR, European symbol; PARTNO: CL10B822KB8SFNC
C33 = resistor:C-EU: CAPACITOR, European symbol; PARTNO: CL10C7R5DB8NNNC
C34 = resistor:C-EU: CAPACITOR, European symbol; PARTNO: CL10B221KC8WPNC
C41 C42 C49 C50 = res-cap-arrays:4CAP; PARTNO: CKCL44X5R1C223M085AA
C45 = resistor:C-EU: CAPACITOR, European symbol; PARTNO: C1608X7R1H473M
C46 = resistor:C-EU: CAPACITOR, European symbol; PARTNO: CL10C680JB8NNNC
CELL = adafruit-sensor-boards:FONA; PARTNO: BCS-118-L-S-TE
D1-D12 D14-D19 = adafruit:DIODE: Diode SMADIODE - SMA Surface Mount Package 20V 1A Schottky Diode Digikey: 641-1014-6-ND DO-1N4148 - Through Hole Small Current Diode SOD-123 20V 1 A (.5mV Vf) Schottky Diode - Digikey: MBRX120TPMSCT-ND SOD-323 10V 570mA (.38mV Vf, 3ns) Schottky Diode - Digikey: ZLLS410CT-ND SOD-523 30V 30mA Schottky Diode (RB751S-40TE61) - Digikey: RB751S-40TE61CT-ND SOT23-R/W - SOT23 Package (R = Solder Paste/Reflow Ovens, W = Hand-Soldering) BAT54Film 40V 300mA - Digikey: 497-7162-1-ND; PARTNO: CDBW140-G
D13 = adafruit:DIODE: Diode SMADIODE - SMA Surface Mount Package 20V 1A Schottky Diode Digikey: 641-1014-6-ND DO-1N4148 - Through Hole Small Current Diode SOD-123 20V 1 A (.5mV Vf) Schottky Diode - Digikey: MBRX120TPMSCT-ND SOD-323 10V 570mA (.38mV Vf, 3ns) Schottky Diode - Digikey: ZLLS410CT-ND SOD-523 30V 30mA Schottky Diode (RB751S-40TE61) - Digikey: RB751S-40TE61CT-ND SOT23-R/W - SOT23 Package (R = Solder Paste/Reflow Ovens, W = Hand-Soldering) BAT54Film 40V 300mA - Digikey: 497-7162-1-ND; PARTNO: MMSZ4678-TP
D20 D36 = ARD-SRG-MOT8-1a:SPARKFUN_DIODE: Diode These are standard reverse protection diodes and small signal diodes. SMA package can handle up to about 1A. SOD-323 can handle about 200mA. What the SOD-323 package when ordering, there are some mfgs out there that are 5-pin packages.; PARTNO: SK310A-LTP
D21-D28 = adafruit:DIODE: Diode SMADIODE - SMA Surface Mount Package 20V 1A Schottky Diode Digikey: 641-1014-6-ND DO-1N4148 - Through Hole Small Current Diode SOD-123 20V 1 A (.5mV Vf) Schottky Diode - Digikey: MBRX120TPMSCT-ND SOD-323 10V 570mA (.38mV Vf, 3ns) Schottky Diode - Digikey: ZLLS410CT-ND SOD-523 30V 30mA Schottky Diode (RB751S-40TE61) - Digikey: RB751S-40TE61CT-ND SOT23-R/W - SOT23 Package (R = Solder Paste/Reflow Ovens, W = Hand-Soldering) BAT54Film 40V 300mA - Digikey: 497-7162-1-ND; PARTNO: SMF5.0A
DISARM = adafruit:LED: LED OSRAM: - CHIPLED LG R971, LG N971, LY N971, LG Q971, LY Q971, LO R971, LY R971 LH N974, LH R974 LS Q976, LO Q976, LY Q976 LO Q996 - Hyper CHIPLED LW Q18S LB Q993, LB Q99A, LB R99A - SideLED LS A670, LO A670, LY A670, LG A670, LP A670 LB A673, LV A673, LT A673, LW A673 LH A674 LY A675 LS A676, LA A676, LO A676, LY A676, LW A676 LS A679, LY A679, LG A679 - Hyper Micro SIDELED® LS Y876, LA Y876, LO Y876, LY Y876 LT Y87S - SmartLED LW L88C, LW L88S LB L89C, LB L89S, LG L890 LS L89K, LO L89K, LY L89K LS L896, LA L896, LO L896, LY L896 - TOPLED LS T670, LO T670, LY T670, LG T670, LP T670 LSG T670, LSP T670, LSY T670, LOP T670, LYG T670 LG T671, LOG T671, LSG T671 LB T673, LV T673, LT T673, LW T673 LH T674 LS T676, LA T676, LO T676, LY T676, LB T676, LH T676, LSB T676, LW T676 LB T67C, LV T67C, LT T67C, LS T67K, LO T67K, LY T67K, LW E67C LS E67B, LA E67B, LO E67B, LY E67B, LB E67C, LV E67C, LT E67C LW T67C LS T679, LY T679, LG T679 LS T770, LO T770, LY T770, LG T770, LP T770 LB T773, LV T773, LT T773, LW T773 LH T774 LS E675, LA E675, LY E675, LS T675 LS T776, LA T776, LO T776, LY T776, LB T776 LHGB T686 LT T68C, LB T68C - Hyper Mini TOPLED® LB M676 - Mini TOPLED Santana® LG M470 LS M47K, LO M47K, LY M47K Source: http://www.osram.convergy.de/; PARTNO: HSMA-C170
ENABLE/DISARM = SparkFun-Connectors:M05: Header 5 Standard 5-pin 0.1" header. Use with straight break away headers (SKU : PRT-00116), right angle break away headers (PRT-00553), swiss pins (PRT-00743), machine pins (PRT-00117), and female headers (PRT-00115). Molex polarized connector foot print use with SKU : PRT-08230 with associated crimp pins and housings.; BOM: EXCLUDE; PARTNO: *
F1 F2 = fuses:PTC; PARTNO: MF-LSMF300/24X-2
GPS = adafruit-sensor-boards:ULTIMATE-GPS; PARTNO: BCS-109-L-S-TE
H1 H3 H4 H7 = holes:MOUNT-PAD-ROUND: MOUNTING PAD, round; BOM: EXCLUDE; PARTNO: ?
HORN = con-molex-c-grid-sl:HEADER_POS2_?: Molex -C-Grid® / SL Series connector Wire-to-Board 2.54 mm (0.100") pitch header, 2 positions.; PARTNO: 0705550036
IC1 = 74xx-little-us:74*1G08: 2-input AND gate; PARTNO: MC74HC1G08DTT1G
IC2 = 74xx-little-us:74*1G06: Single Inverter Buffer/Driver With Open-Drain Output; PARTNO: SN74LVC1G06DBVR
IC3 = 74xx-little-us:74*1G04: INVERTER Gate; PARTNO: MC74HC1G04DTT1G
IC4 IC5 = linear:78*: Positive VOLTAGE REGULATOR Source: http://cache.national.com/ds/LM/LM78L05.pdf http://www.fairchildsemi.com/ds/LM/LM7805.pdf; PARTNO: V7805-2000
IMU = adafruit-sensor-boards:9-DOF-BREAKOUT; PARTNO: BCS-110-L-S-TE
J1 J2 J10 J11 = SparkFun-Connectors:M03: Header 3 Standard 3-pin 0.1" header. Use with straight break away headers (SKU : PRT-00116), right angle break away headers (PRT-00553), swiss pins (PRT-00743), machine pins (PRT-00117), and female headers (PRT-00115). Molex polarized connector foot print use with SKU : PRT-08232 with associated crimp pins and housings.; BOM: EXCLUDE; PARTNO: ?
J3 = SparkFun-Connectors:M04: Header 4 Standard 4-pin 0.1" header. Use with straight break away headers (SKU : PRT-00116), right angle break away headers (PRT-00553), swiss pins (PRT-00743), machine pins (PRT-00117), and female headers (PRT-00115). Molex polarized connector foot print use with SKU : PRT-08231 with associated crimp pins and housings. 1MM SMD Version SKU: PRT-10208; BOM: EXCLUDE; PARTNO: *; PROD_ID: CONN-09696
J5 = SparkFun-Connectors:M09: Header 9 Standard 9-pin 0.1" header. Use with straight break away headers (SKU : PRT-00116), right angle break away headers (PRT-00553), swiss pins (PRT-00743), machine pins (PRT-00117), and female headers (PRT-00115).; BOM: EXCLUDE; PARTNO: *
J6 = SparkFun-Connectors:M10: Header 10 Standard 10-pin 0.1" header. Use with straight break away headers (SKU : PRT-00116), right angle break away headers (PRT-00553), swiss pins (PRT-00743), machine pins (PRT-00117), and female headers (PRT-00115).; BOM: EXCLUDE; PARTNO: *
J7 = SparkFun-Connectors:M18: 1x18 .1" header; BOM: EXCLUDE; PARTNO: *
J9 = SparkFun-Connectors:M02: Standard 2-pin 0.1" header. Use with - straight break away headers ( PRT-00116) - right angle break away headers (PRT-00553) - swiss pins (PRT-00743) - machine pins (PRT-00117) - female headers (PRT-00115) Molex polarized connector foot print use with: PRT-08233 with associated crimp pins and housings. 2.54_SCREWTERM for use with PRT-10571. 3.5mm Screw Terminal footprints for PRT-08084 5mm Screw Terminal footprints for use with PRT-08432; BOM: EXCLUDE; PARTNO: ?
L2 = logos-inductors:NR60: Taiyo Yuden low profile power inductor; PARTNO: NR6045T220M
L3 = logos-inductors:SRN8040; PARTNO: SRN8040-220M
MOTOR-CTRL-RELAYS = SparkFun-Connectors:DB9: DB9 Connector Standard DB9 (D-Sub 9) serial connector. Can be used for CAN bus as well as RS485 and RS232. Footprint production proven. Spark Fun Electronics SKU : PRT-00429; PARTNO: 1734354-1; PROD_ID: CONN-08194
POE-DEVICE POE-LAN = SparkFun-Connectors:RJ45-8: RJ45 Jack Simple RJ45, 8-pin connection - connector for common Cat5, Cat5e, and Cat6 Ethernet cables. Footprint not yet proven in production. Connector sku is PRT-00643; Breakout PCB sku is BOB-00716.; PARTNO: 615008137121; PROD_ID: CONN-08506
POWER_INPUT = logos-headers:3-1437664-0: TE Connectivity 3-1437664-0; PARTNO: NC6-P108-02
POWER_MON = pinhead-1:PINHD-2X6: PIN HEADER; PARTNO: *
POWER_STATE = con-molex-c-grid-sl:HEADER_POS5_?: Molex -C-Grid® / SL Series connector Wire-to-Board 2.54 mm (0.100") pitch header, 5 positions.; PARTNO: 0705550039
R1-R3 R7-R9 R13-R15 R25 R29 R30 R34-R36 R42-R44 R48 R57 R69-R71 R75-R77 R81-R83 R97-R99 = resistor:R-EU_: RESISTOR, European symbol; PARTNO: RNCP0603FTD10K0
R4 R10 R16 R31 R37 R45 R72 R78 R84 = resistor:R-EU_: RESISTOR, European symbol; PARTNO: CRCW0603100KFKEA
R5 R11 R17 R32 R40 R46 R55 R73 R79 R85 = resistor:R-EU_: RESISTOR, European symbol; PARTNO: PE2512FKE070R05L
R6 R12 R18 R33 R41 R47 R56 R74 R80 R86 = resistor:R-EU_: RESISTOR, European symbol; PARTNO: ERJ-3EKF3302V
R19 R20 R51-R54 = resistor:R-EU_: RESISTOR, European symbol; PARTNO: RC1608J472CS
R24 R38 R39 R62-R68 R87-R96 R100-R109 = resistor:R-EU_: RESISTOR, European symbol; PARTNO: RMCF0603FT1K00
R26 = resistor:R-EU_: RESISTOR, European symbol; PARTNO: RC0603FR-0711K5L
R27 = resistor:R-EU_: RESISTOR, European symbol; PARTNO: RC0603FR-0710K2L
R28 = resistor:R-EU_: RESISTOR, European symbol; PARTNO: RC0603FR-071K24L
R49 = resistor:R-EU_: RESISTOR, European symbol; PARTNO: RC0603JR-07110KL
R50 = resistor:R-EU_: RESISTOR, European symbol; PARTNO: RC0603JR-0715KL
R58 = resistor:R-EU_: RESISTOR, European symbol; PARTNO: RC0603FR-07174KL
R59 = resistor:R-EU_: RESISTOR, European symbol; PARTNO: RC0603FR-071K62L
R60 = resistor:R-EU_: RESISTOR, European symbol; PARTNO: ERJ-3EKF1823V
R61 = resistor:R-EU_: RESISTOR, European symbol; PARTNO: RC0603FR-0716K2L
R110-R113 = res-cap-arrays:4R-N: Array Chip Resistor Source: RS Component / Phycomp; PARTNO: 742C083103JPTR
SBUS-IN SBUS-OUT = con-molex-c-grid-sl:HEADER_POS3_?: Molex -C-Grid® / SL Series connector Wire-to-Board 2.54 mm (0.100") pitch header, 3 positions.; PARTNO: 0705450037
SERIAL_CONSOLE = con-molex-c-grid-sl:HEADER_POS4_?: Molex -C-Grid® / SL Series connector Wire-to-Board 2.54 mm (0.100") pitch header, 4 positions.; PARTNO: 0705550038
SJ1 = jumper:SJ2W: SMD solder JUMPER; BOM: EXCLUDE; PARTNO: ?
SJ2 = jumper:SJ: SMD solder JUMPER; BOM: EXCLUDE; PARTNO: *
T1 = SparkFun-DiscreteSemi:MOSFET-PCHANNEL-SOIC8: Generic 8-pin PMOSFET; PARTNO: AO4407A
U1 U2 U4 U6 U8 U11 U20 U22 U24 = hackerbot:IPS6041: IPS6041 -- Intelligent Power High Side Switch 39V, 7A, 130 mOhm Rds(on) Made by International Rectifier Drawn by Pierce Nichols; PARTNO: IPS6041GPBF
U3 U5 U7 U9 U10 U12 U21 U23 U25 U27 = logos-power:INA169; PARTNO: INA169NA/3K
U13 U16 U17 = adafruit:TXB0108PWR: 8-Bit Bi-Directional Level Shifter 1.2V-3.6V (VCCA) to 1.65V-5.5V (VCCB) bi-directional level shifter with auto direction sensing. Max data rate - VCCA 1.8V: 20Mbps (50ns), VCCA 3.3V: 100Mbps (10ns) Digikey: 296-21527-1-ND; PARTNO: TXB0108PWR
U15 = logos-power:TPS54331: 3-28V 3A buck regulator; PARTNO: TPS54331DR
U18 U19 = ti-stuff:ADC128D818; PARTNO: ADC128D818CIMTX
U26 = adafruit:TXS0102: 2-Bit Bi-Directional Level Shifter (I2C, etc.) Designed for I2C devices and has internal pullups. Not to be confused with TXB010x series. 1.2V-3.6V (VCCA) to 1.65V-5.5V (VCCB) bi-directional level shifter with auto direction sensing. Max data rate - 24Mbps (Push Pull), 2Mbps (Open Drain) Digikey: 296-21931-1-ND; PARTNO: TXS0102DCURG4
U28 = SparkFun-DigitalIC:RS485: RS485 transceiver; PARTNO: SN75176BDR
U29 = logos-power:TPS61175; PARTNO: TPS61175PWPR
U$1 = adafruit:BEAGLEBONE_OUTLINE: Should match A3 pinout - but not completely tested; BOM: EXCLUDE; PARTNO: ?
U$2-U$5 = SparkFun-Connectors:M24: 1x24 .1" header; BOM: EXCLUDE; PARTNO: *